# Altium project radxa_nx5_io_board_v1.4.PrjPcb (part 1 of 2)
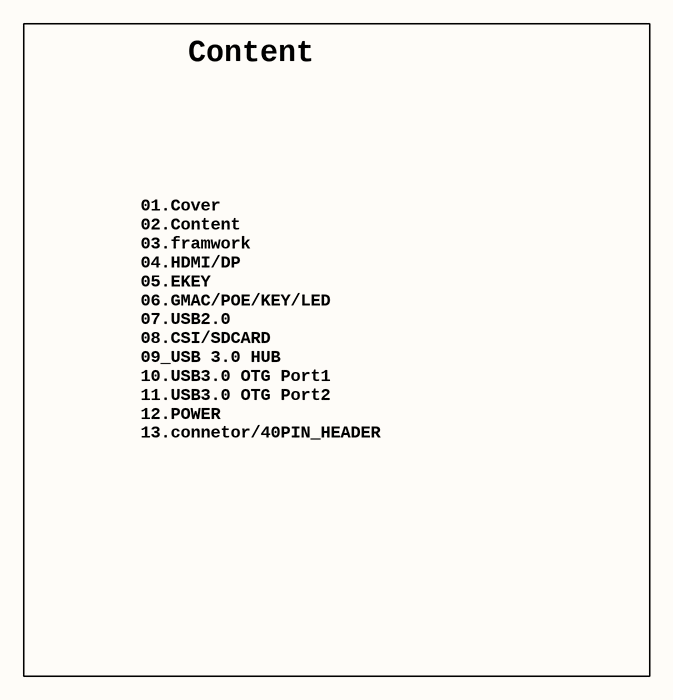
[diagram p0: 02.SchDoc]
12 sheets, 296 parts. Net scope: flat (ports and power ports of the same name join across sheets).
Sheets:
  01.SchDoc
  02.SchDoc
  03.SchDoc
  04.SchDoc
  05.SchDoc
  06.SchDoc
  07.SchDoc
  08.SchDoc
  10.SchDoc
  11.SchDoc
  12.SchDoc
  13.SchDoc

## Sheet 01.SchDoc
size 297 x 209 mm

## Sheet 02.SchDoc
size 297 x 209 mm

### Notes on the sheet
- Content
- 01.Cover
  02.Content
  03.framwork
  04.HDMI/DP
  05.EKEY
  06.GMAC/POE/KEY/LED
  07.USB2.0
  08.CSI/SDCARD
  09_USB 3.0 HUB
  10.USB3.0 OTG Port1
  11.USB3.0 OTG Port2
  12.POWER
  13.connetor/40PIN_HEADER

## Sheet 03.SchDoc
size 297 x 209 mm
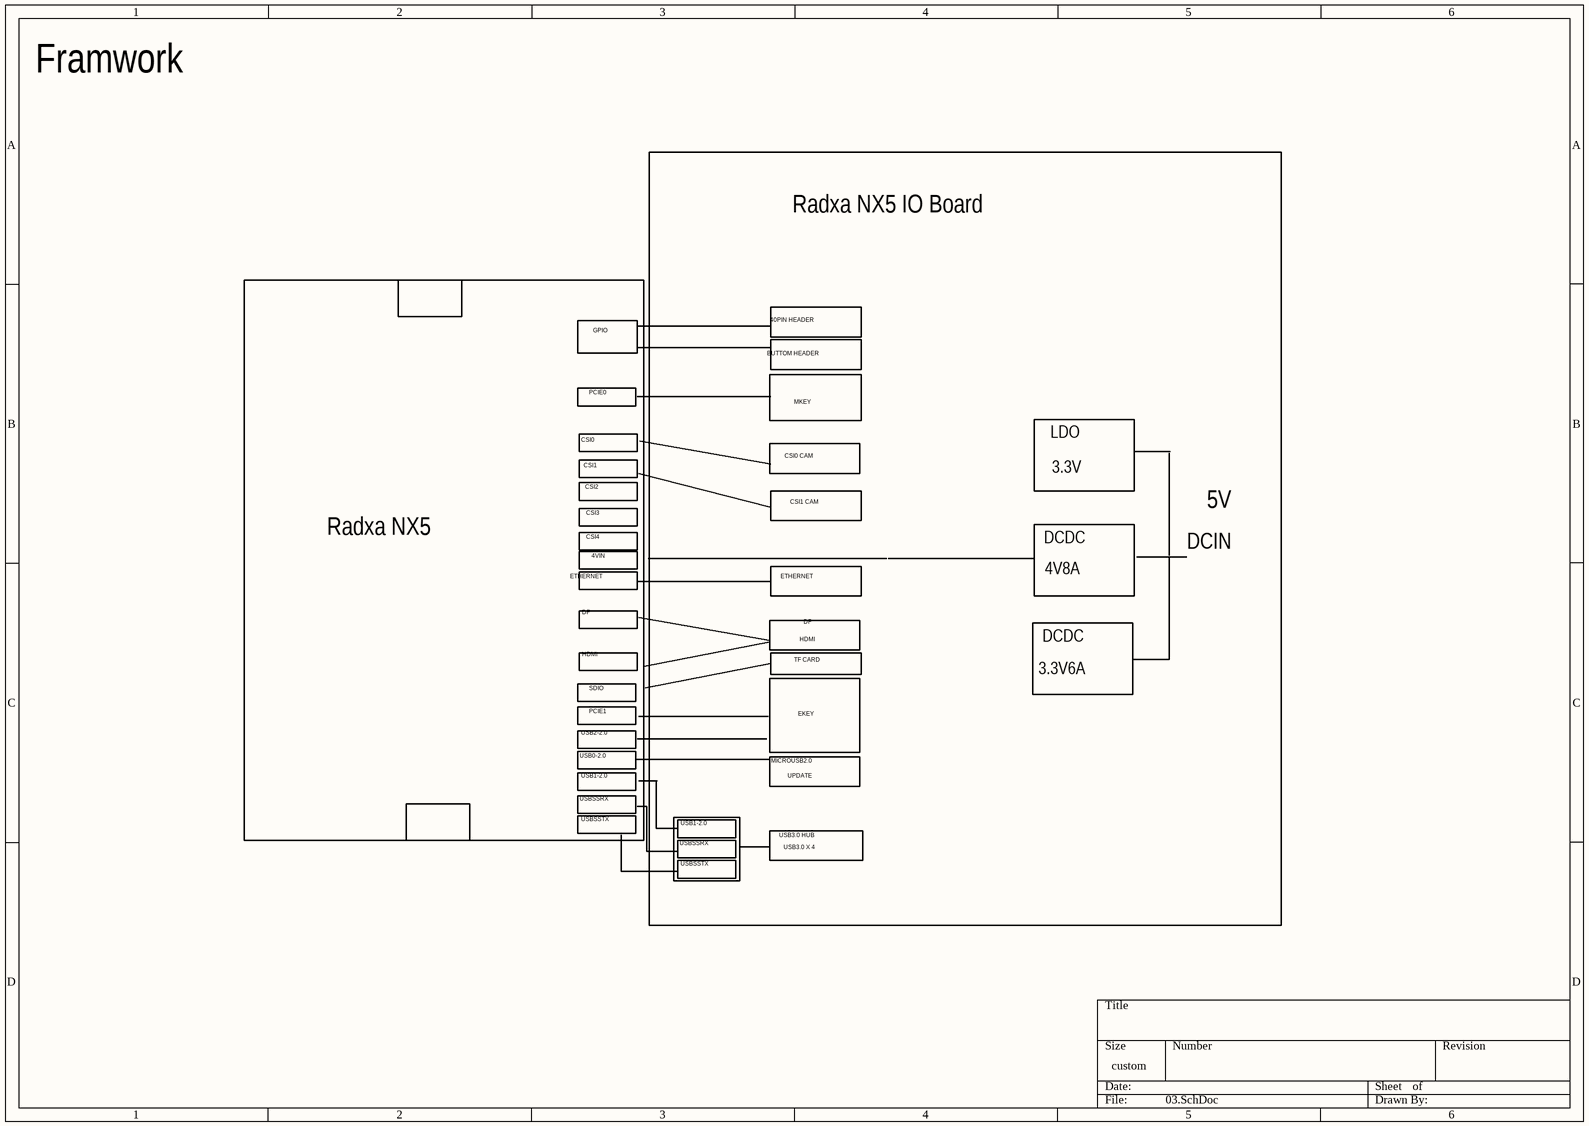
[diagram p1: 03.SchDoc]

### Notes on the sheet
- Framwork
- Radxa NX5 IO Board
- GPIO
- 40PIN HEADER
- PCIE0
- BUTTOM HEADER
- MKEY
- CSI0
- CSI1
- CSI0 CAM
- LDO
- 3.3V
- Radxa NX5
- CSI2
- CSI3
- CSI4
- CSI1 CAM
- 5V
- ETHERNET
- 4VIN
- DCDC
- 4V8A
- DCIN
- HDMI
- DP
- TF CARD
- 3.3V6A
- USB2-2.0
- PCIE1
- SDIO
- EKEY
- USB0-2.0
- USBSSRX
- USB1-2.0
- MICROUSB2.0
- UPDATE
- USBSSTX
- USB3.0 HUB
- USB3.0 X 4

## Sheet 04.SchDoc
size 594 x 420 mm
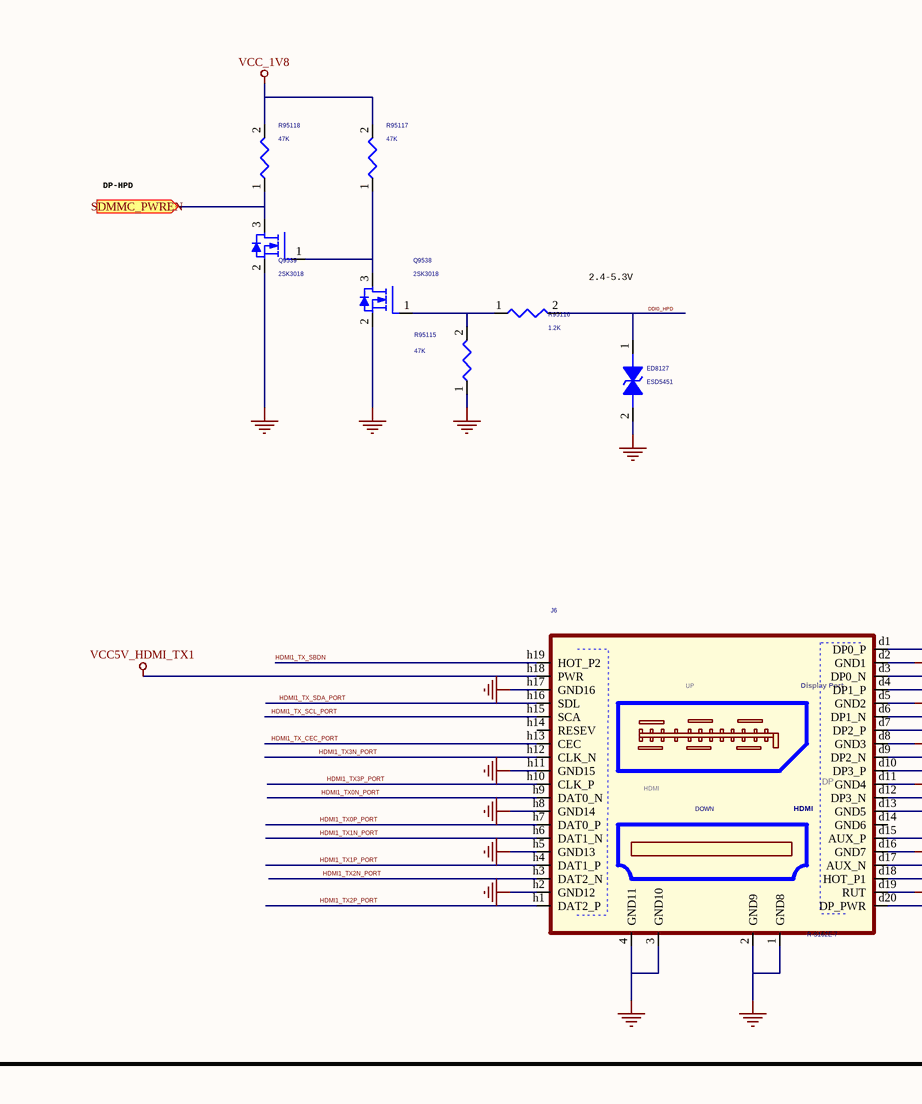
[diagram p2: 04.SchDoc, top left]
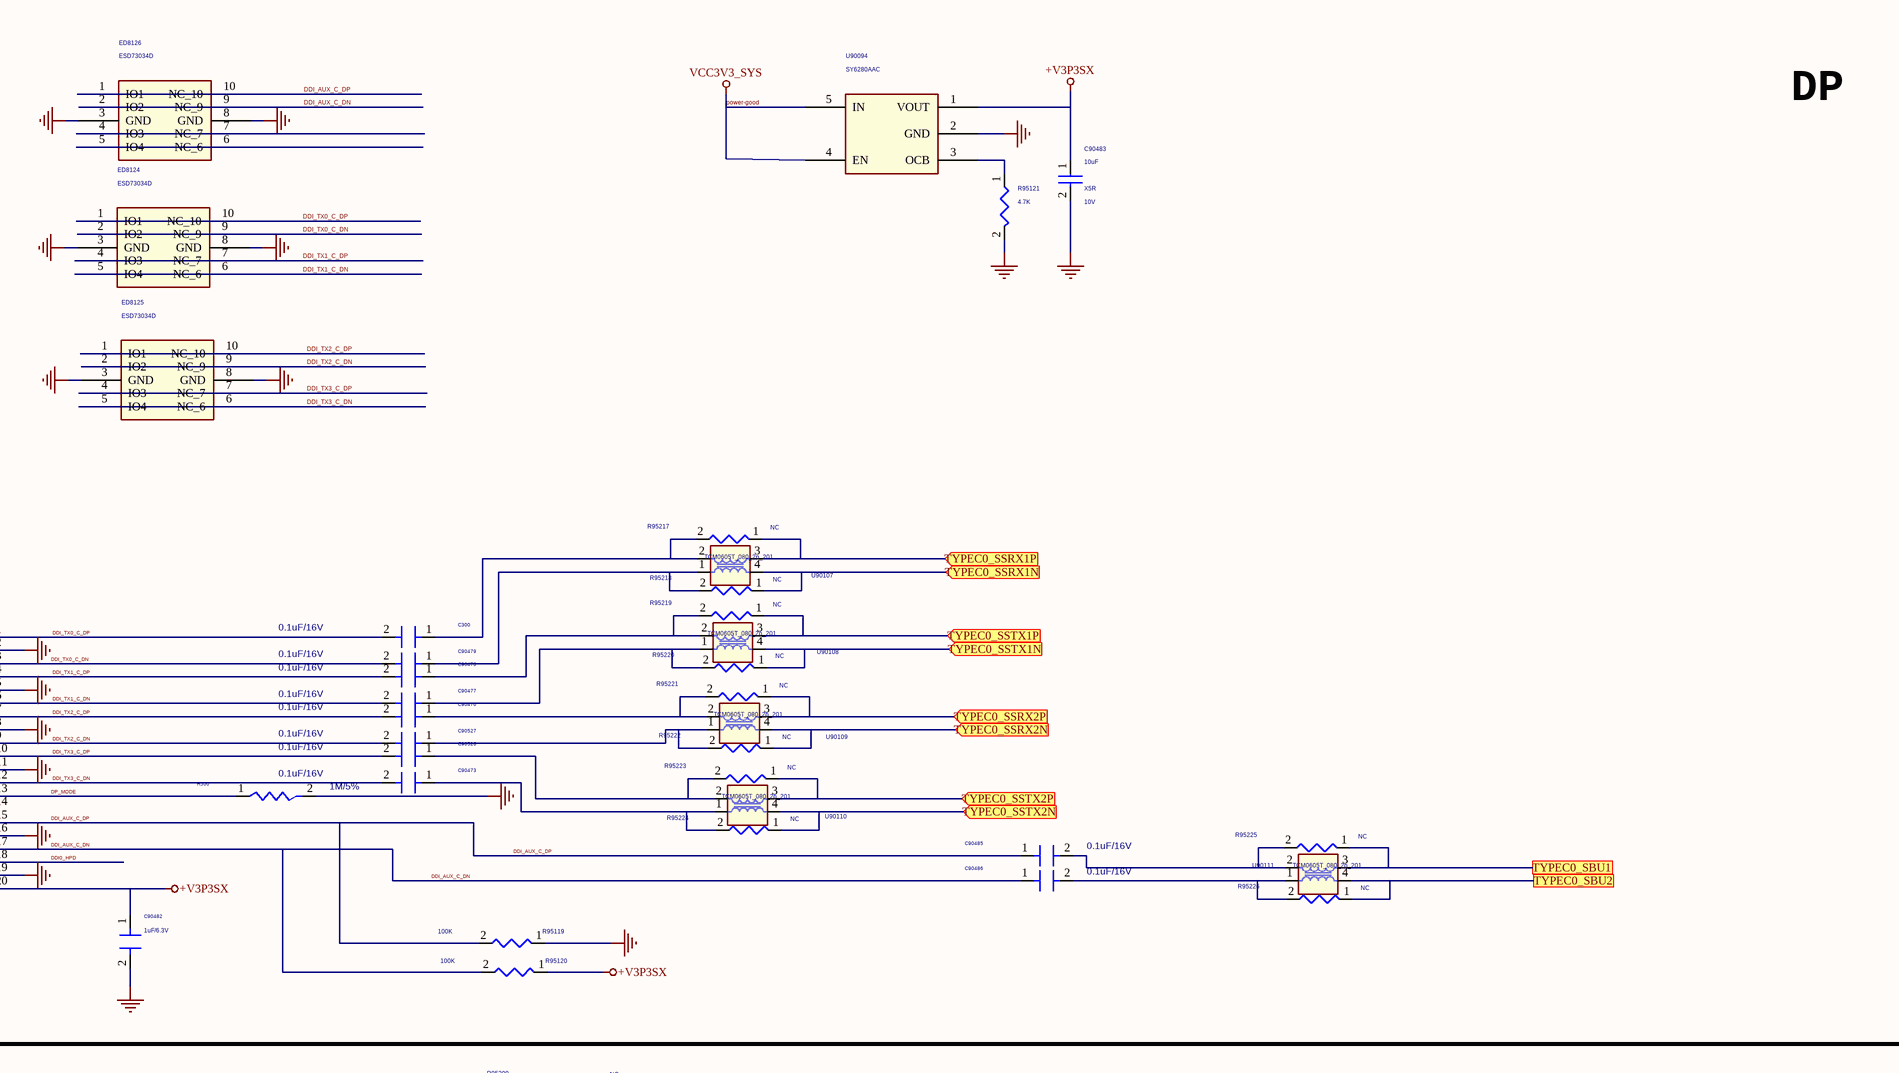
[diagram p3: 04.SchDoc, top right]
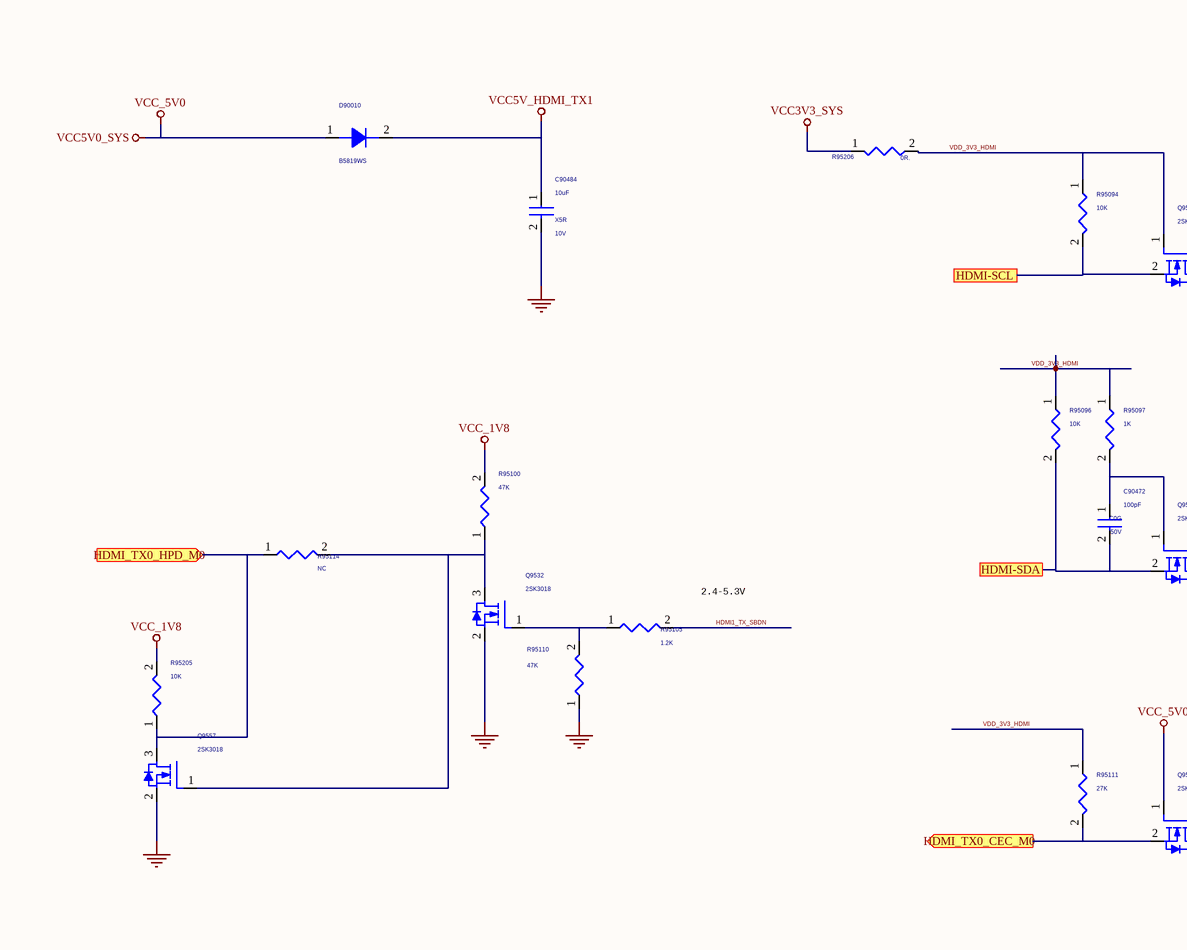
[diagram p4: 04.SchDoc, bottom left]
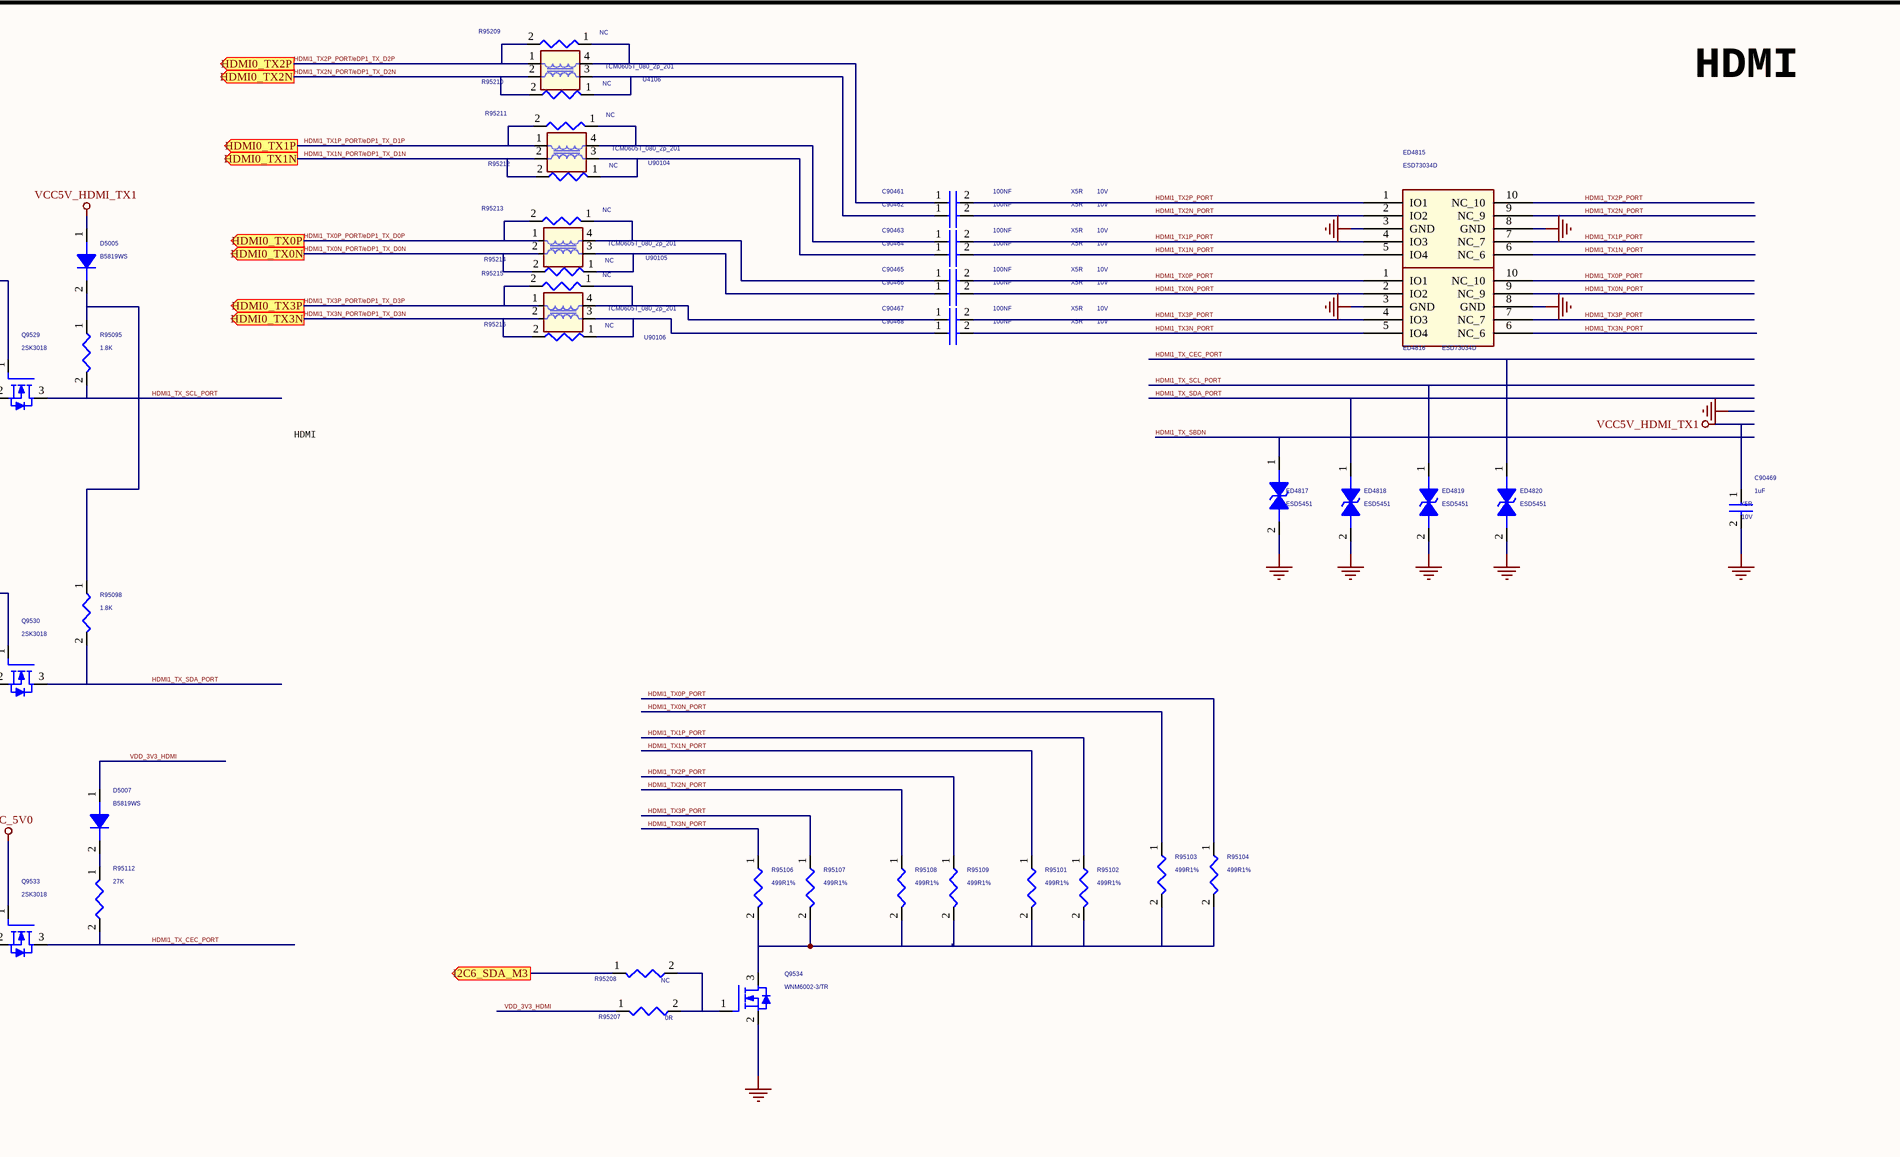
[diagram p5: 04.SchDoc, bottom right]

### Parts
C300  0.1uF/16V  [SMC0201]
C90461  100NF  Voltage: 10V  Dielectric: X5R  [C0201]
C90462  100NF  Voltage: 10V  Dielectric: X5R  [C0201]
C90463  100NF  Voltage: 10V  Dielectric: X5R  [C0201]
C90464  100NF  Voltage: 10V  Dielectric: X5R  [C0201]
C90465  100NF  Voltage: 10V  Dielectric: X5R  [C0201]
C90466  100NF  Voltage: 10V  Dielectric: X5R  [C0201]
C90467  100NF  Voltage: 10V  Dielectric: X5R  [C0201]
C90468  100NF  Voltage: 10V  Dielectric: X5R  [C0201]
C90469  1uF  Voltage: 10V  Dielectric: X5R  [C0402]
C90472  100pF  Voltage: 50V  Dielectric: C0G  [C0402]
C90473  0.1uF/16V  [SMC0201]
C90476  0.1uF/16V  [SMC0201]
C90477  0.1uF/16V  [SMC0201]
C90478  0.1uF/16V  [SMC0201]
C90479  0.1uF/16V  [SMC0201]
C90482  1uF/6.3V  [SMC0402]
C90483  10uF  Voltage: 10V  Dielectric: X5R  [C0603]
C90484  10uF  Voltage: 10V  Dielectric: X5R  [C0603]
C90485  0.1uF/16V  [SMC0201]
C90486  0.1uF/16V  [SMC0201]
C90526  0.1uF/16V  [SMC0201]
C90527  0.1uF/16V  [SMC0201]
D5005  B5819WS  [SOD_323]
D5007  B5819WS  [SOD_323]
D90010  B5819WS  [SOD_323]
ED4815  ESD73034D  [SON10_2R50X1R00X0R50]
ED4816  ESD73034D  [SON10_2R50X1R00X0R50]
ED4817  ESD5451  [ESD0402]
ED4818  ESD5451  [ESD0402]
ED4819  ESD5451  [ESD0402]
ED4820  ESD5451  [ESD0402]
ED8124  ESD73034D  [SON10_2R50X1R00X0R50]
ED8125  ESD73034D  [SON10_2R50X1R00X0R50]
ED8126  ESD73034D  [SON10_2R50X1R00X0R50]
ED8127  ESD5451  [ESD0402]
J6  R-S162E-7  [A]
Q9529  2SK3018  [SOT23]
Q9530  2SK3018  [SOT23]
Q9532  2SK3018  [SOT23]
Q9533  2SK3018  [SOT23]
Q9534  WNM6002-3/TR  [SOT23]
Q9538  2SK3018  [SOT23]
Q9539  2SK3018  [SOT23]
Q9557  2SK3018  [SOT23]
R500  1M/5%  [SMR0402]
R95094  10K  [R0402]
R95095  1.8K  [R0402]
R95096  10K  [R0402]
R95097  1K  [R0402]
R95098  1.8K  [R0402]
R95100  47K  [R0402]
R95101  499R1%  [R0402]
R95102  499R1%  [R0402]
R95103  499R1%  [R0402]
R95104  499R1%  [R0402]
R95105  1.2K  [R0402]
R95106  499R1%  [R0402]
R95107  499R1%  [R0402]
R95108  499R1%  [R0402]
R95109  499R1%  [R0402]
R95110  47K  [R0402]
R95111  27K  [R0402]
R95112  27K  [R0402]
R95114  NC  [R0402]
R95115  47K  [R0402]
R95116  1.2K  [R0402]
R95117  47K  [R0402]
R95118  47K  [R0402]
R95119  100K  [R0402]
R95120  100K  [R0402]
R95121  4.7K  [R0402]
R95205  10K  [R0402]
R95206  0R.  [R0402]
R95207  0R  [R0402]
R95208  NC  [R0402]
R95209  NC  [R0402]
R95210  NC  [R0402]
R95211  NC  [R0402]
R95212  NC  [R0402]
R95213  NC  [R0402]
R95214  NC  [R0402]
R95215  NC  [R0402]
R95216  NC  [R0402]
R95217  NC  [R0402]
R95218  NC  [R0402]
R95219  NC  [R0402]
R95220  NC  [R0402]
R95221  NC  [R0402]
R95222  NC  [R0402]
R95223  NC  [R0402]
R95224  NC  [R0402]
R95225  NC  [R0402]
R95226  NC  [R0402]
U4106  TCM0605T_080_2p_201  [QTCW2012]
U90094  SY6280AAC  [SOT_23_5]
U90104  TCM0605T_080_2p_201  [QTCW2012]
U90105  TCM0605T_080_2p_201  [QTCW2012]
U90106  TCM0605T_080_2p_201  [QTCW2012]
U90107  TCM0605T_080_2p_201  [QTCW2012]
U90108  TCM0605T_080_2p_201  [QTCW2012]
U90109  TCM0605T_080_2p_201  [QTCW2012]
U90110  TCM0605T_080_2p_201  [QTCW2012]
U90111  TCM0605T_080_2p_201  [QTCW2012]

### Ports
HDMI0_TX0N (out), HDMI0_TX0P (out), HDMI0_TX1N (out), HDMI0_TX1P (out), HDMI0_TX2N (out), HDMI0_TX2P (out), HDMI0_TX3N (out), HDMI0_TX3P (out), HDMI-SCL, HDMI-SDA, HDMI_TX0_CEC_M0 (out), HDMI_TX0_HPD_M0 (in), I2C6_SDA_M3 (out), SDMMC_PWREN (in), TYPEC0_SBU1, TYPEC0_SBU2, TYPEC0_SSRX1N (in), TYPEC0_SSRX1P (in), TYPEC0_SSRX2N (in), TYPEC0_SSRX2P (in), TYPEC0_SSTX1N (in), TYPEC0_SSTX1P (in), TYPEC0_SSTX2N (in), TYPEC0_SSTX2P (in)

### Nets
+V3P3SX: C90482.1(A[0]) C90483.1 J6.d20(DP_PWR) R95120.1 U90094.1(VOUT)
GND: C90469.2 C90482.2(B[0]) C90483.2 C90484.2 ED4815.3(GND) ED4815.8(GND) ED4816.3(GND) ED4816.8(GND) ED4817.2 ED4818.2 ED4819.2 ED4820.2 ED8124.3(GND) ED8124.8(GND) ED8125.3(GND) ED8125.8(GND) ED8126.3(GND) ED8126.8(GND) ED8127.2 J6.1(GND8) J6.2(GND9) J6.3(GND10) J6.4(GND11) J6.d2(GND1) J6.d5(GND2) J6.d8(GND3) J6.d11(GND4) J6.d16(GND7) J6.d19(RUT) J6.h2(GND12) J6.h5(GND13) J6.h8(GND14) J6.h11(GND15) J6.h17(GND16) Q9532.2(SOURCE) Q9534.2(SOURCE) Q9538.2(SOURCE) Q9539.2(SOURCE) Q9557.2(SOURCE) R500.2(B[0]) R95110.1 R95115.1 R95119.1 R95121.2 U90094.2(GND)
power-good: R95206.1 U90094.4(EN) U90094.5(IN)  [also labelled VCC3V3_SYS]
VCC5V0_SYS: D90010.1(A) Q9533.1(GATE)  [also labelled VCC_5V0]  [project net DCIN]
VCC5V_HDMI_TX1: C90469.1 C90484.1 D5005.1(A) D90010.2(K) J6.h18(PWR)
VCC_1V8: R95100.2 R95117.2 R95118.2 R95205.2
DDI0_HPD: ED8127.1 J6.d18(HOT_P1) R95116.2
DDI_AUX_C_DN: C90486.1(A[0]) ED8126.2(IO2) ED8126.9(NC_9) J6.d17(AUX_N) R95120.2
DDI_AUX_C_DP: C90485.1(A[0]) ED8126.1(IO1) ED8126.10(NC_10) J6.d15(AUX_P) R95119.2
DDI_TX0_C_DN: C90479.2(B[0]) ED8124.2(IO2) ED8124.9(NC_9) J6.d3(DP0_N)
DDI_TX0_C_DP: C300.2(B[0]) ED8124.1(IO1) ED8124.10(NC_10) J6.d1(DP0_P)
DDI_TX1_C_DN: C90477.2(B[0]) ED8124.5(IO4) ED8124.6(NC_6) J6.d6(DP1_N)
DDI_TX1_C_DP: C90478.2(B[0]) ED8124.4(IO3) ED8124.7(NC_7) J6.d4(DP1_P)
DDI_TX2_C_DN: C90527.2(B[0]) ED8125.2(IO2) ED8125.9(NC_9) J6.d9(DP2_N)
DDI_TX2_C_DP: C90476.2(B[0]) ED8125.1(IO1) ED8125.10(NC_10) J6.d7(DP2_P)
DDI_TX3_C_DN: C90473.2(B[0]) ED8125.5(IO4) ED8125.6(NC_6) J6.d12(DP3_N)
DDI_TX3_C_DP: C90526.2(B[0]) ED8125.4(IO3) ED8125.7(NC_7) J6.d10(DP3_P)
DP_MODE: J6.d13(GND5) R500.1(A[0])
HDMI1_TX0N_PORT: C90466.2 ED4816.2(IO2) ED4816.9(NC_9) J6.h9(DAT0_N) R95103.1
HDMI1_TX0N_PORT/eDP1_TX_D0N: R95214.2 U90105.2 ; port HDMI0_TX0N
HDMI1_TX0P_PORT: C90465.2 ED4816.1(IO1) ED4816.10(NC_10) J6.h7(DAT0_P) R95104.1
HDMI1_TX0P_PORT/eDP1_TX_D0P: R95213.2 U90105.1 ; port HDMI0_TX0P
HDMI1_TX1N_PORT: C90464.2 ED4815.5(IO4) ED4815.6(NC_6) J6.h6(DAT1_N) R95101.1
HDMI1_TX1N_PORT/eDP1_TX_D1N: R95212.2 U90104.2 ; port HDMI0_TX1N
HDMI1_TX1P_PORT: C90463.2 ED4815.4(IO3) ED4815.7(NC_7) J6.h4(DAT1_P) R95102.1
HDMI1_TX1P_PORT/eDP1_TX_D1P: R95211.2 U90104.1 ; port HDMI0_TX1P
HDMI1_TX2N_PORT: C90462.2 ED4815.2(IO2) ED4815.9(NC_9) J6.h3(DAT2_N) R95108.1
HDMI1_TX2N_PORT/eDP1_TX_D2N: R95210.2 U4106.2 ; port HDMI0_TX2N
HDMI1_TX2P_PORT: C90461.2 ED4815.1(IO1) ED4815.10(NC_10) J6.h1(DAT2_P) R95109.1
HDMI1_TX2P_PORT/eDP1_TX_D2P: R95209.2 U4106.1 ; port HDMI0_TX2P
HDMI1_TX3N_PORT: C90468.2 ED4816.5(IO4) ED4816.6(NC_6) J6.h12(CLK_N) R95106.1
HDMI1_TX3N_PORT/eDP1_TX_D3N: R95216.2 U90106.2 ; port HDMI0_TX3N
HDMI1_TX3P_PORT: C90467.2 ED4816.4(IO3) ED4816.7(NC_7) J6.h10(CLK_P) R95107.1
HDMI1_TX3P_PORT/eDP1_TX_D3P: R95215.2 U90106.1 ; port HDMI0_TX3P
HDMI1_TX_CEC_PORT: ED4820.1 J6.h13(CEC) Q9533.3(DRAIN) R95112.2
HDMI1_TX_SBDN: ED4817.1 J6.h19(HOT_P2) R95105.2
HDMI1_TX_SCL_PORT: ED4819.1 J6.h15(SCA) Q9529.3(DRAIN) R95095.2
HDMI1_TX_SDA_PORT: ED4818.1 J6.h16(SDL) Q9530.3(DRAIN) R95098.2
VDD_3V3_HDMI: D5007.1(A) Q9529.1(GATE) R95094.1 R95096.1 R95097.1 R95111.1 R95206.2 R95207.1
NetC300_1: C300.1(A[0]) R95217.2 U90107.2
NetC90461_1: C90461.1 R95209.1 U4106.4
NetC90462_1: C90462.1 R95210.1 U4106.3
NetC90463_1: C90463.1 R95211.1 U90104.4
NetC90464_1: C90464.1 R95212.1 U90104.3
NetC90465_1: C90465.1 R95213.1 U90105.4
NetC90466_1: C90466.1 R95214.1 U90105.3
NetC90467_1: C90467.1 R95215.1 U90106.4
NetC90468_1: C90468.1 R95216.1 U90106.3
NetC90472_1: C90472.1 Q9530.1(GATE) R95097.2
NetC90472_2: C90472.2 Q9530.2(SOURCE) R95096.2 ; port HDMI-SDA
NetC90473_1: C90473.1(A[0]) R95224.2 U90110.1
NetC90476_1: C90476.1(A[0]) R95221.2 U90109.2
NetC90477_1: C90477.1(A[0]) R95220.2 U90108.1
NetC90478_1: C90478.1(A[0]) R95219.2 U90108.2
NetC90479_1: C90479.1(A[0]) R95218.2 U90107.1
NetC90485_2: C90485.2(B[0]) R95225.2 U90111.2
NetC90486_2: C90486.2(B[0]) R95226.2 U90111.1
NetC90526_1: C90526.1(A[0]) R95223.2 U90110.2
NetC90527_1: C90527.1(A[0]) R95222.2 U90109.1
NetD5005_2: D5005.2(K) R95095.1 R95098.1
NetD5007_2: D5007.2(K) R95112.1
NetED8126_4: ED8126.4(IO3) ED8126.7(NC_7)
NetED8126_5: ED8126.5(IO4) ED8126.6(NC_6)
NetQ9529_2: Q9529.2(SOURCE) R95094.2 ; port HDMI-SCL
NetQ9532_1: Q9532.1(GATE) R95105.1 R95110.2
NetQ9532_3: Q9532.3(DRAIN) Q9557.1(GATE) R95100.1 R95114.2
NetQ9533_2: Q9533.2(SOURCE) R95111.2 ; port HDMI_TX0_CEC_M0
NetQ9534_1: Q9534.1(GATE) R95207.2 R95208.2
NetQ9534_3: Q9534.3(DRAIN) R95101.2 R95102.2 R95103.2 R95104.2 R95106.2 R95107.2 R95108.2 R95109.2
NetQ9538_1: Q9538.1(GATE) R95115.2 R95116.1
NetQ9538_3: Q9538.3(DRAIN) Q9539.1(GATE) R95117.1
NetQ9539_3: Q9539.3(DRAIN) R95118.1 ; port SDMMC_PWREN
NetQ9557_3: Q9557.3(DRAIN) R95114.1 R95205.1 ; port HDMI_TX0_HPD_M0
NetR95121_1: R95121.1 U90094.3(OCB)
NetR95208_1: R95208.1 ; port I2C6_SDA_M3
NetR95217_1: R95217.1 U90107.3 ; port TYPEC0_SSRX1P
NetR95218_1: R95218.1 U90107.4 ; port TYPEC0_SSRX1N
NetR95219_1: R95219.1 U90108.3 ; port TYPEC0_SSTX1P
NetR95220_1: R95220.1 U90108.4 ; port TYPEC0_SSTX1N
NetR95221_1: R95221.1 U90109.3 ; port TYPEC0_SSRX2P
NetR95222_1: R95222.1 U90109.4 ; port TYPEC0_SSRX2N
NetR95223_1: R95223.1 U90110.3 ; port TYPEC0_SSTX2P
NetR95224_1: R95224.1 U90110.4 ; port TYPEC0_SSTX2N
NetR95225_1: R95225.1 U90111.3 ; port TYPEC0_SBU1
NetR95226_1: R95226.1 U90111.4 ; port TYPEC0_SBU2

Not connected (* = marked no-connect by the designer): J6 d14(GND6) h14(RESEV)

### Notes on the sheet
- DP
- DP-HPD
- 2.4-5.3V
- HDMI
- (near R95105) 2.4-5.3V
- (in symbol DP+HDMI_1) UP; Display Port; DP; HDMI; DOWN

### Library data of the parts
C300 C90473 C90476 C90486 C90526 = CAP_ALTSIZE: PART_NUMBER: J30788-001; CDS_PART_NAME: CAP_ALTSIZE_0402-0.22UF,10%,16A; MATERIAL: X5R; PACK_TYPE: 0402; ROOM: USB_TYPE_C; TOLERANCE: 10%; VOLTAGE: 16V; OriginalSymbolOrigin: (-50,50); POP2: TYPEC_DP_USB; POP: BASE; CDS_LIB: capacitor; CDS_LOCATION: C4532; DRAWING: @APL_FF_LIN.APL_FF(SCH_1):PAGE72; PHYS_PAGE: 43; ROT: 0; SUB_ROOM: AC_CAP; VER: 2; XY: (-1275,4600); SIZE: 1B; VARIANT: ?; STUFF: STUFF; CDS_PHYS_PART_NAME: CAP_ALTSIZE_0402-0.22UF,10%,16A; CHIPS_PART_NAME: CAP_ALTSIZE; LOCATION: C4532
C90461 C90463 C90465 C90467 C90468 = CAP NP: cap,220.00nF,+/-10%,10V,X5R,C0201; Manufacturer PN: C0603X5R1A224K030BB; Manufacturer: TDK; Tolerance: 10%; Priority: A; Created by: JJJ; Part Type: C0201; RK PN: C0603X5R1A224K030BB
C90462 C90464 C90466 = CAP NP: cap,220.00nF,+/-10%,10V,X5R,C0201; Manufacturer: TDK; RK PN: C0603X5R1A224K030BB; Priority: A; Tolerance: 10%; Part Type: C0201; Manufacturer PN: C0603X5R1A224K030BB; Created by: JJJ
C90469 = CAP NP: cap,1.00uF,+/-10%,10V,X5R,C0402; Manufacturer PN: C1005X5R1A105K050BB; Manufacturer: TDK; Tolerance: 10%; Priority: A; Number: 37; Created by: JJJ; C_Voltage: 10V; Part Type: C0402; RK PN: C1005X5R1A105K050BB
C90472 = CAP NP: cap,100.00pF,+/-10%,50V,C0G,C0402; Manufacturer: TDK; Number: 37; RK PN: C1005C0G1H101K050BA; Priority: A; Tolerance: 10%; C_Voltage: 10V; Part Type: C0402; Manufacturer PN: C1005C0G1H101K050BA; Created by: JJJ
C90477 C90479 C90485 C90527 = CAP_ALTSIZE: PART_NUMBER: J30788-001; CDS_PHYS_PART_NAME: CAP_ALTSIZE_0402-0.22UF,10%,16A; MATERIAL: X5R; PACK_TYPE: 0402; ROOM: USB_TYPE_C; TOLERANCE: 10%; VOLTAGE: 16V; OriginalSymbolOrigin: (-50,50); POP2: TYPEC_DP_USB; XY: (-1275,4600); VER: 2; SUB_ROOM: AC_CAP; ROT: 0; PHYS_PAGE: 43; LOCATION: C4532; DRAWING: @APL_FF_LIN.APL_FF(SCH_1):PAGE72; CDS_LIB: capacitor; POP: BASE; SIZE: 1B; VARIANT: ?; CHIPS_PART_NAME: CAP_ALTSIZE; CDS_PART_NAME: CAP_ALTSIZE_0402-0.22UF,10%,16A; CDS_LOCATION: C4532; STUFF: STUFF
C90478 = CAP_ALTSIZE: PART_NUMBER: J30788-001; CDS_PHYS_PART_NAME: CAP_ALTSIZE_0402-0.22UF,10%,16A; MATERIAL: X5R; PACK_TYPE: 0402; ROOM: USB_TYPE_C; TOLERANCE: 10%; VOLTAGE: 16V; OriginalSymbolOrigin: (-50,50); XY: (-1275,4600); VER: 2; SUB_ROOM: AC_CAP; ROT: 0; PHYS_PAGE: 43; LOCATION: C4532; DRAWING: @APL_FF_LIN.APL_FF(SCH_1):PAGE72; CDS_LIB: capacitor; POP: BASE; POP2: TYPEC_DP_USB; SIZE: 1B; VARIANT: ?; CHIPS_PART_NAME: CAP_ALTSIZE; CDS_PART_NAME: CAP_ALTSIZE_0402-0.22UF,10%,16A; CDS_LOCATION: C4532; STUFF: STUFF
C90482 = CAP_2: PART_NUMBER: H35094-001; CDS_PART_NAME: CAP_0402-2.2UF,20%,10V,X5R,H35A; CHIPS_PART_NAME: CAP; OriginalSymbolOrigin: (-50,50); VOLTAGE: 10V; TOLERANCE: 20%; ROOM: DISPLAY_HDMI; PACK_TYPE: 0402; MATERIAL: X5R; POP: BASE; CDS_LIB: capacitor; CDS_LOCATION: C9589; DRAWING: @APL_FF_LIN.APL_FF(SCH_1):PAGE35; PHYS_PAGE: 35; ROT: 0; SUB_ROOM: DECOUPLING; VER: 1; XY: (-3350,2800); POP2: _; VARIANT: ?; SIZE: 1B; REV: V2.0; LOCATION: C9589; SEC_TYPE: 0402; CDS_PHYS_PART_NAME: CAP_0402-2.2UF,20%,10V,X5R,H35A; STUFF: STUFF
C90483 C90484 = CAP NP: cap,10.00uF,+/-10%,10V,X5R,C0805; Manufacturer PN: C2012X5R1A106K125AB; Manufacturer: TDK; Tolerance: 10%; Priority: A; Created by: JJJ; Part Type: C0805; RK PN: C2012X5R1A106K125AB
D5005 = DIODE_Dup2: Schottky Barrier，B5819WS SOD-323; Manufacturer: 长电; Priority: A; RK PN: B5819WS; Part Type: Schottky rectifier; Manufacturer PN: B5819WS; Created by: JJJ
D5007 = DIODE_Dup2: Schottky Barrier，B5819WS SOD-323; Manufacturer: 长电; option: DNP; Priority: A; RK PN: B5819WS; Part Type: Schottky rectifier; Manufacturer PN: B5819WS; Created by: JJJ
D90010 = DIODE_Dup2: Schottky Barrier，B5819WS SOD-323; Manufacturer: 长电; Priority: A; option: DNP; Created by: JJJ; Manufacturer PN: B5819WS; Part Type: Schottky rectifier; RK PN: B5819WS
ED4815 ED4816 ED8124-ED8126 = ESD_ESD5304D: 4-Lines, Uni-directional, Ultra-low Capacitance Transient Voltage Suppressors; Manufacturer: WillSemi(韦尔半导体); Priority: A; RK PN: ESD5304D; Part Type: ESD_TVS; Manufacturer PN: ESD5304D; Created by: JJJ
ED4817-ED4820 = DIODE BI_DIR TRIG: 1-Line, Bi-directional, Transient Voltage Suppressors.1pF.; Manufacturer PN: ESD5341N; Manufacturer: WillSemi(韦尔半导体); Priority: A; Created by: JJJ; Part Type: ESD_TVS; RK PN: ESD5341N
ED8127 = DIODE BI_DIR TRIG: 1-Line, Bi-directional, Transient Voltage Suppressors.1pF.; Manufacturer: WillSemi(韦尔半导体); RK PN: ESD5341N; Priority: A; Part Type: ESD_TVS; Manufacturer PN: ESD5341N; Created by: JJJ
J6 = DP+HDMI_1: CONN DP+HDMI 62EHDS3 39P+4J+2定位柱 卧式 DIP-45 NPB; COMPSIDE: S_BOT; POP: BASE; Remark: Reserved; STUFF: STUFF
Q9529 Q9530 Q9532 Q9533 Q9557 = MOSFET N_0: NMOS,2SK3018,SOT_323,Id=0.1A,Vds=30V; Manufacturer: ROHM; Pd: 0.2W; Vgsth: 1.5V; VDS: 30V; Vgs: 20V; Id_max: 0.1A; Priority: A; Rds: 5ohm; Created by: JJJ; Manufacturer PN: 2SK3018; Part Type: NMOS; RK PN: 2SK3018
Q9534 = MOSFET N_0: NMOS,WNM6002-3/TR,SOT_323,Id=0.3A,Vds=60V; Manufacturer: WillSemi(韦尔半导体); Pd: 0.23W; Vgsth: 1.3V; VDS: 60V; Vgs: ±20V; Id_max: 0.3A; Priority: A; Created by: JJJ; Manufacturer PN: WNM6002-3/TR; Part Type: NMOS; RK PN: WNM6002-3/TR
Q9538 Q9539 = MOSFET N_0: NMOS,2SK3018,SOT_323,Id=0.1A,Vds=30V; Manufacturer: ROHM; Rds: 5ohm; Priority: A; Id_max: 0.1A; Vgs: 20V; VDS: 30V; Vgsth: 1.5V; Pd: 0.2W; RK PN: 2SK3018; Part Type: NMOS; Manufacturer PN: 2SK3018; Created by: JJJ
R500 = RES#2: PART_NUMBER: A93549-023; CHIPS_PART_NAME: RES; CDS_PHYS_PART_NAME: RES_0402-10K,5%,1/16W,CH,A9354A; PACK_TYPE: 0402; ROOM: USB_TYPE_C; TOLERANCE: 5%; WATTAGE: 1/16W; OriginalSymbolOrigin: (-50,100); POP: BASE; XY: (-2550,2250); VER: 2; SUB_ROOM: MISC; ROT: 0; PHYS_PAGE: 43; LOCATION: R4590; DRAWING: @APL_FF_LIN.APL_FF(SCH_1):PAGE72; CDS_LIB: resistor; POP2: TYPEC_DP_USB; MATERIAL: CH; SIZE: 1B; STUFF: STUFF; CDS_PART_NAME: RES_0402-10K,5%,1/16W,CH,A9354A; CDS_LOCATION: R4590
R95094 R95208-R95224 = RESISTOR: 通用厚膜电阻,10K,+/-5%,R0402,1/16W.; Manufacturer PN: RC0402JR-0710KL; Manufacturer: YAGEO; Tolerance: 5%; Wattage: 1/16W; Priority: A; Created by: YTL; Part Type: 通用厚膜电阻; RK PN: RC0402JR-0710KL
R95095 = RESISTOR: 通用厚膜电阻,1K8,+/-5%,R0402,1/16W.; Manufacturer: YAGEO; Tolerance: 5%; RK PN: RC0402JR-071K8L; Priority: A; Wattage: 1/16W; Part Type: 通用厚膜电阻; Manufacturer PN: RC0402JR-071K8L; Created by: YTL
R95096 R95206 R95207 R95225 R95226 = RESISTOR: 通用厚膜电阻,10K,+/-5%,R0402,1/16W.; Manufacturer: YAGEO; Tolerance: 5%; RK PN: RC0402JR-0710KL; Priority: A; Wattage: 1/16W; Part Type: 通用厚膜电阻; Manufacturer PN: RC0402JR-0710KL; Created by: YTL
R95097 = RESISTOR: 通用厚膜电阻,1K,+/-5%,R0402,1/16W.; Manufacturer PN: RC0402JR-071KL; Manufacturer: YAGEO; Tolerance: 5%; Wattage: 1/16W; Priority: A; Created by: YTL; Part Type: 通用厚膜电阻; RK PN: RC0402JR-071KL
R95098 = RESISTOR: 通用厚膜电阻,1K8,+/-5%,R0402,1/16W.; Manufacturer PN: RC0402JR-071K8L; Manufacturer: YAGEO; Tolerance: 5%; Wattage: 1/16W; Priority: A; Created by: YTL; Part Type: 通用厚膜电阻; RK PN: RC0402JR-071K8L
R95100 R95115 R95117 = RESISTOR: 通用厚膜电阻,47K,+/-5%,R0402,1/16W.; Manufacturer: YAGEO; Tolerance: 5%; RK PN: RC0402JR-0747KL; Priority: A; Wattage: 1/16W; Part Type: 通用厚膜电阻; Manufacturer PN: RC0402JR-0747KL; Created by: YTL
R95101 R95103 R95107-R95109 = RESISTOR: 通用厚膜电阻,499R,+/-1%,R0201,1/20W.; Manufacturer PN: RC0201FR-07499RL; Manufacturer: YAGEO; Tolerance: 1%; Wattage: 1/20W; Priority: A; Created by: YTL; Part Type: 通用厚膜电阻; RK PN: RC0201FR-07499RL
R95102 R95104 R95106 = RESISTOR: 通用厚膜电阻,499R,+/-1%,R0201,1/20W.; Manufacturer: YAGEO; Tolerance: 1%; RK PN: RC0201FR-07499RL; Priority: A; Wattage: 1/20W; Part Type: 通用厚膜电阻; Manufacturer PN: RC0201FR-07499RL; Created by: YTL
R95105 R95114 = RESISTOR: 通用厚膜电阻,1K2,+/-5%,R0402,1/16W.; Manufacturer PN: RC0402JR-071K2L; Manufacturer: YAGEO; Tolerance: 5%; Wattage: 1/16W; Priority: A; Created by: YTL; Part Type: 通用厚膜电阻; RK PN: RC0402JR-071K2L
R95110 R95118 R95205 = RESISTOR: 通用厚膜电阻,47K,+/-5%,R0402,1/16W.; Manufacturer PN: RC0402JR-0747KL; Manufacturer: YAGEO; Tolerance: 5%; Wattage: 1/16W; Priority: A; Created by: YTL; Part Type: 通用厚膜电阻; RK PN: RC0402JR-0747KL
R95111 = RESISTOR: 通用厚膜电阻,27K,+/-5%,R0402,1/16W.; Manufacturer PN: RC0402JR-0727KL; Manufacturer: YAGEO; Tolerance: 5%; Wattage: 1/16W; Priority: A; Created by: YTL; Part Type: 通用厚膜电阻; RK PN: RC0402JR-0727KL
R95112 = RESISTOR: 通用厚膜电阻,27K,+/-5%,R0402,1/16W.; Manufacturer PN: RC0402JR-0727KL; Manufacturer: YAGEO; Tolerance: 5%; OPTION: DNP; Wattage: 1/16W; Priority: A; Created by: YTL; Part Type: 通用厚膜电阻; RK PN: RC0402JR-0727KL
R95116 = RESISTOR: 通用厚膜电阻,1K2,+/-5%,R0402,1/16W.; Manufacturer: YAGEO; Tolerance: 5%; RK PN: RC0402JR-071K2L; Priority: A; Wattage: 1/16W; Part Type: 通用厚膜电阻; Manufacturer PN: RC0402JR-071K2L; Created by: YTL
R95119 = RESISTOR: 通用厚膜电阻,100K,+/-5%,R0402,1/16W.; Manufacturer PN: RC0402JR-07100KL; Manufacturer: YAGEO; Tolerance: 5%; Wattage: 1/16W; Priority: A; Created by: YTL; Part Type: 通用厚膜电阻; RK PN: RC0402JR-07100KL
R95120 = RESISTOR: 通用厚膜电阻,100K,+/-5%,R0402,1/16W.; Manufacturer: YAGEO; Tolerance: 5%; RK PN: RC0402JR-07100KL; Priority: A; Wattage: 1/16W; Part Type: 通用厚膜电阻; Manufacturer PN: RC0402JR-07100KL; Created by: YTL
R95121 = RESISTOR: 通用厚膜电阻,9K1,+/-1%,R0402,1/16W.; Manufacturer: YAGEO; Tolerance: 1%; RK PN: RC0402FR-079K1L; Priority: A; Wattage: 1/16W; Part Type: 通用厚膜电阻; Manufacturer PN: RC0402FR-079K1L; Created by: YTL
U4106 U90104-U90111 = QTCW2012-090-LF_0: Part-V: NC-E2012-090-F
U90094 = SWITCH_SY6280: Low Loss Power Distribution Switch; Manufacturer: Silergy（矽力杰）; Priority: A; RK PN: SY6280AAC; Part Type: Switch; Manufacturer PN: SY6280AAC; Created by: JJJ

## Sheet 05.SchDoc
size 297 x 209 mm
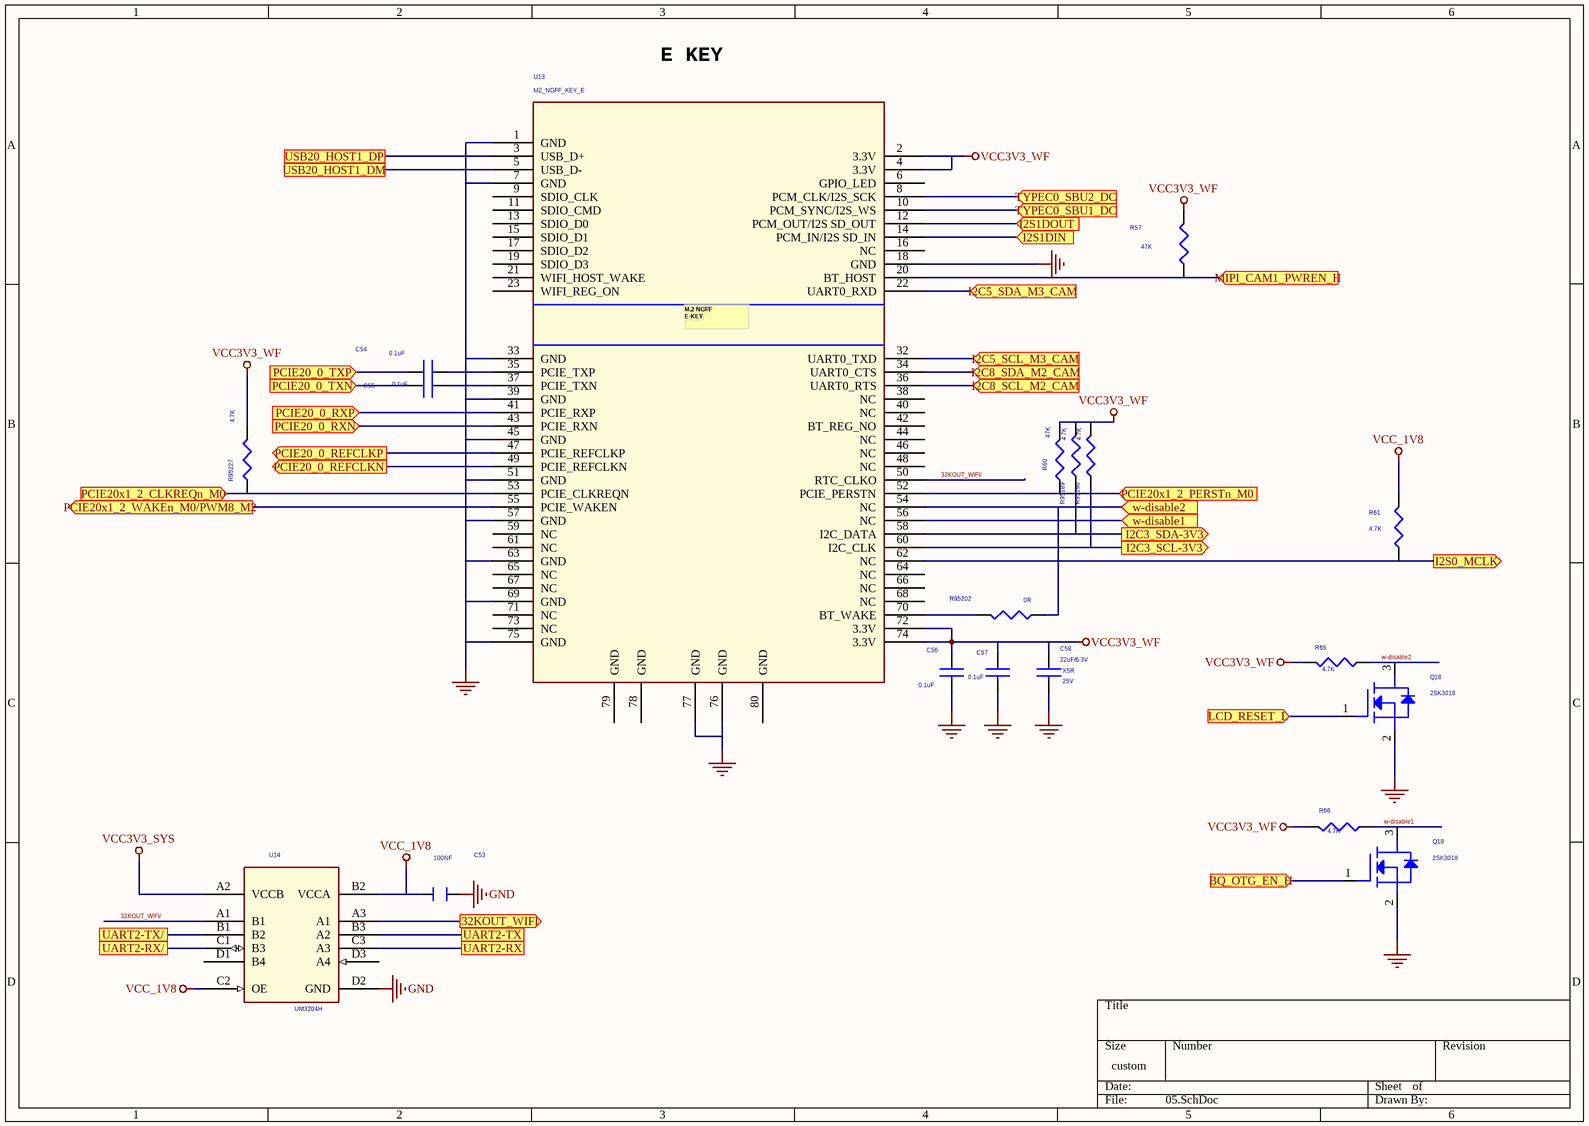
[diagram p6: 05.SchDoc]

### Parts
C53  100NF  [C0402]
C54  0.1uF  [C0603]
C55  0.1uF  [C0603]
C56  0.1uF  [C0402]
C57  0.1uF  [C0402]
C58  22uF/6.3V  Dielectric: X5R  Voltage: 25V  [C0805]
Q18  2SK3018  [SOT23]
Q19  2SK3018  [SOT23]
R57  47K  [R0402]
R60  47K  [R0402]
R61  4.7K  [R0402]
R65  4.7K  [R0402]
R66  4.7K  [R0402]
R95189  4.7K  [R0402]
R95190  4.7K  [R0402]
R95202  0R  [R0402]
R95227  4.7K  [R0402]
U13  M2_NGFF_KEY_E  [M2_NGFF_KEY_E_1]
U14  UM3204H  [CSP-12]

### Ports
32KOUT_WIFI (out), BQ_OTG_EN_H (in), I2C3_SCL-3V3 (out), I2C3_SDA-3V3 (out), I2C5_SCL_M3_CAM (in), I2C5_SDA_M3_CAM (in), I2C8_SCL_M2_CAM (in), I2C8_SDA_M2_CAM (in), I2S0_MCLK (out), I2S1DIN (in), I2S1DOUT (in), LCD_RESET_L (in), MIPI_CAM1_PWREN_H (in), PCIE20_0_REFCLKN (out), PCIE20_0_REFCLKP (out), PCIE20_0_RXN (in), PCIE20_0_RXP (in), PCIE20_0_TXN (in), PCIE20_0_TXP (in), PCIE20x1_2_CLKREQn_M0 (in), PCIE20x1_2_PERSTn_M0 (in), PCIE20x1_2_WAKEn_M0/PWM8_M2 (out), TYPEC0_SBU1_DC (in), TYPEC0_SBU2_DC (in), UART2-RX, UART2-RX/, UART2-TX, UART2-TX/, USB20_HOST1_DM, USB20_HOST1_DP, w-disable1 (in), w-disable2 (in)

### Nets
GND: C53.1 C56.2 C57.2 C58.2 Q18.2(SOURCE) Q19.2(SOURCE) U13.1(GND) U13.7(GND) U13.18(GND) U13.33(GND) U13.39(GND) U13.45(GND) U13.51(GND) U13.57(GND) U13.63(GND) U13.69(GND) U13.75(GND) U13.76(GND) U13.77(GND) U14.D2(GND)
VCC3V3_SYS: U14.A2(VCCB)  [project net power-good]
VCC3V3_WF: C56.1 C57.1 C58.1 R57.2 R60.2 R65.2 R66.2 R95189.2 R95190.2 R95227.2 U13.2(3.3V) U13.4(3.3V) U13.72(3.3V) U13.74(3.3V)
VCC_1V8: C53.2 R61.2 U14.B2(VCCA) U14.C2(OE)
32KOUT_WIFI/: U13.50(RTC_CLKO) U14.A1(B1)
w-disable1: Q19.3(DRAIN) R66.1
w-disable2: Q18.3(DRAIN) R65.1
NetC54_1: C54.1 U13.35(PCIE_TXP)
NetC54_2: C54.2 ; port PCIE20_0_TXP
NetC55_1: C55.1 U13.37(PCIE_TXN)
NetC55_2: C55.2 ; port PCIE20_0_TXN
NetCON1_8: U14.B1(B2) ; port UART2-TX/
NetCON1_10: U14.C1(B3) ; port UART2-RX/
NetQ18_1: Q18.1(GATE) ; port LCD_RESET_L
NetQ19_1: Q19.1(GATE) ; port BQ_OTG_EN_H
NetR57_1: R57.1 U13.20(BT_HOST) ; port MIPI_CAM1_PWREN_H
NetR60_1: R60.1 U13.52(PCIE_PERSTN) ; port PCIE20x1_2_PERSTn_M0
NetR61_1: R61.1 U13.62(NC) ; port I2S0_MCLK
NetR95189_1: R95189.1 U13.58(I2C_DATA) ; port I2C3_SDA-3V3
NetR95190_1: R95190.1 U13.60(I2C_CLK) ; port I2C3_SCL-3V3
NetR95202_1: R95202.1 U13.54(NC) ; port w-disable2
NetR95202_2: R95202.2 U13.70(BT_WAKE)
NetR95227_1: R95227.1 U13.53(PCIE_CLKREQN) ; port PCIE20x1_2_CLKREQn_M0
NetU1_99: U13.32(UART0_TXD) ; port I2C5_SCL_M3_CAM
NetU1_101: U13.22(UART0_RXD) ; port I2C5_SDA_M3_CAM
NetU1_103: U13.36(UART0_RTS) ; port I2C8_SCL_M2_CAM
NetU1_105: U13.34(UART0_CTS) ; port I2C8_SDA_M2_CAM
NetU1_121: U13.5(USB_D-) ; port USB20_HOST1_DM
NetU1_123: U13.3(USB_D+) ; port USB20_HOST1_DP
NetU1_131: U13.43(PCIE_RXN) ; port PCIE20_0_RXN
NetU1_133: U13.41(PCIE_RXP) ; port PCIE20_0_RXP
NetU1_160: U13.49(PCIE_REFCLKN) ; port PCIE20_0_REFCLKN
NetU1_162: U13.47(PCIE_REFCLKP) ; port PCIE20_0_REFCLKP
NetU1_179: U13.55(PCIE_WAKEN) ; port PCIE20x1_2_WAKEn_M0/PWM8_M2
NetU1_210: U14.A3(A1) ; port 32KOUT_WIFI
NetU1_220: U13.12(PCM_OUT/I2S_SD_OUT) ; port I2S1DOUT
NetU1_222: U13.14(PCM_IN/I2S_SD_IN) ; port I2S1DIN
NetU1_224: U13.10(PCM_SYNC/I2S_WS) ; port TYPEC0_SBU1_DC
NetU1_226: U13.8(PCM_CLK/I2S_SCK) ; port TYPEC0_SBU2_DC
NetU1_236: U14.B3(A2) ; port UART2-TX
NetU1_238: U14.C3(A3) ; port UART2-RX
NetU13_56: U13.56(NC) ; port w-disable1

Not connected (* = marked no-connect by the designer): U13 6(GPIO_LED) 9(SDIO_CLK) 11(SDIO_CMD) 13(SDIO_D0) 15(SDIO_D1) 16(NC) 17(SDIO_D2) 19(SDIO_D3) 21(WIFI_HOST_WAKE) 23(WIFI_REG_ON) 38(NC) 40(NC) 42(BT_REG_NO) 44(NC) 46(NC) 48(NC) 59(NC) 61(NC) 64(NC) 65(NC) 66(NC) 67(NC) 68(NC) 71(NC) 73(NC) 78(GND) 79(GND) 80(GND); U14 D1(B4) D3(A4)

### Notes on the sheet
- E KEY
- (in symbol M_4.2 NGFF EKEY SOCKET) M.2 NGFF / E-KEY

### Library data of the parts
C53 = CAPACITOR_0: PAGE: 1
C54 C55 = CAP NP_Dup3: RoHS CHIP CAP 1uF +10/-10% 16V X5R
C56 C57 = CAP NP_2: cap,100.00nF,+/-10%,6.3V,X5R,C0402; Manufacturer PN: C1005X5R0J104K050BA; Manufacturer: TDK; Voltage: 16V; Tolerance: 10%; Priority: A; Dielectric: X5R; Created by: JJJ; Part Type: C0402; RK PN: C1005X5R0J104K050BA
C58 = CAP NP_2: cap,4.70uF,+/-10%,6.3V,X5R,C0603; Manufacturer: TDK; RK PN: C1608X5R0J475K080AB; Priority: A; Tolerance: 10%; Part Type: C0603; Manufacturer PN: C1608X5R0J475K080AB; Created by: JJJ
Q18 Q19 = MOSFET N_Dup1: NMOS,2SK3018,SOT_323,Id=0.1A,Vds=30V; Manufacturer: ROHM; Priority: A; Id_max: 0.1A; Vgs: 20V; VDS: 30V; Vgsth: 1.5V; Pd: 0.2W; Rds: 5ohm; RK PN: 2SK3018; Part Type: NMOS; Manufacturer PN: 2SK3018; Created by: JJJ
R57 R60 R61 R65 R66 R95189 R95190 R95202 R95227 = R_2
U13 = M_4.2 NGFF EKEY SOCKET
U14 = MP2610_0: 4-bit Bi-directional Level Shifter UM3204H; Part Number: PI4ULS5V104GAEX; Vendor: PERICOM

## Sheet 06.SchDoc
size 420 x 297 mm
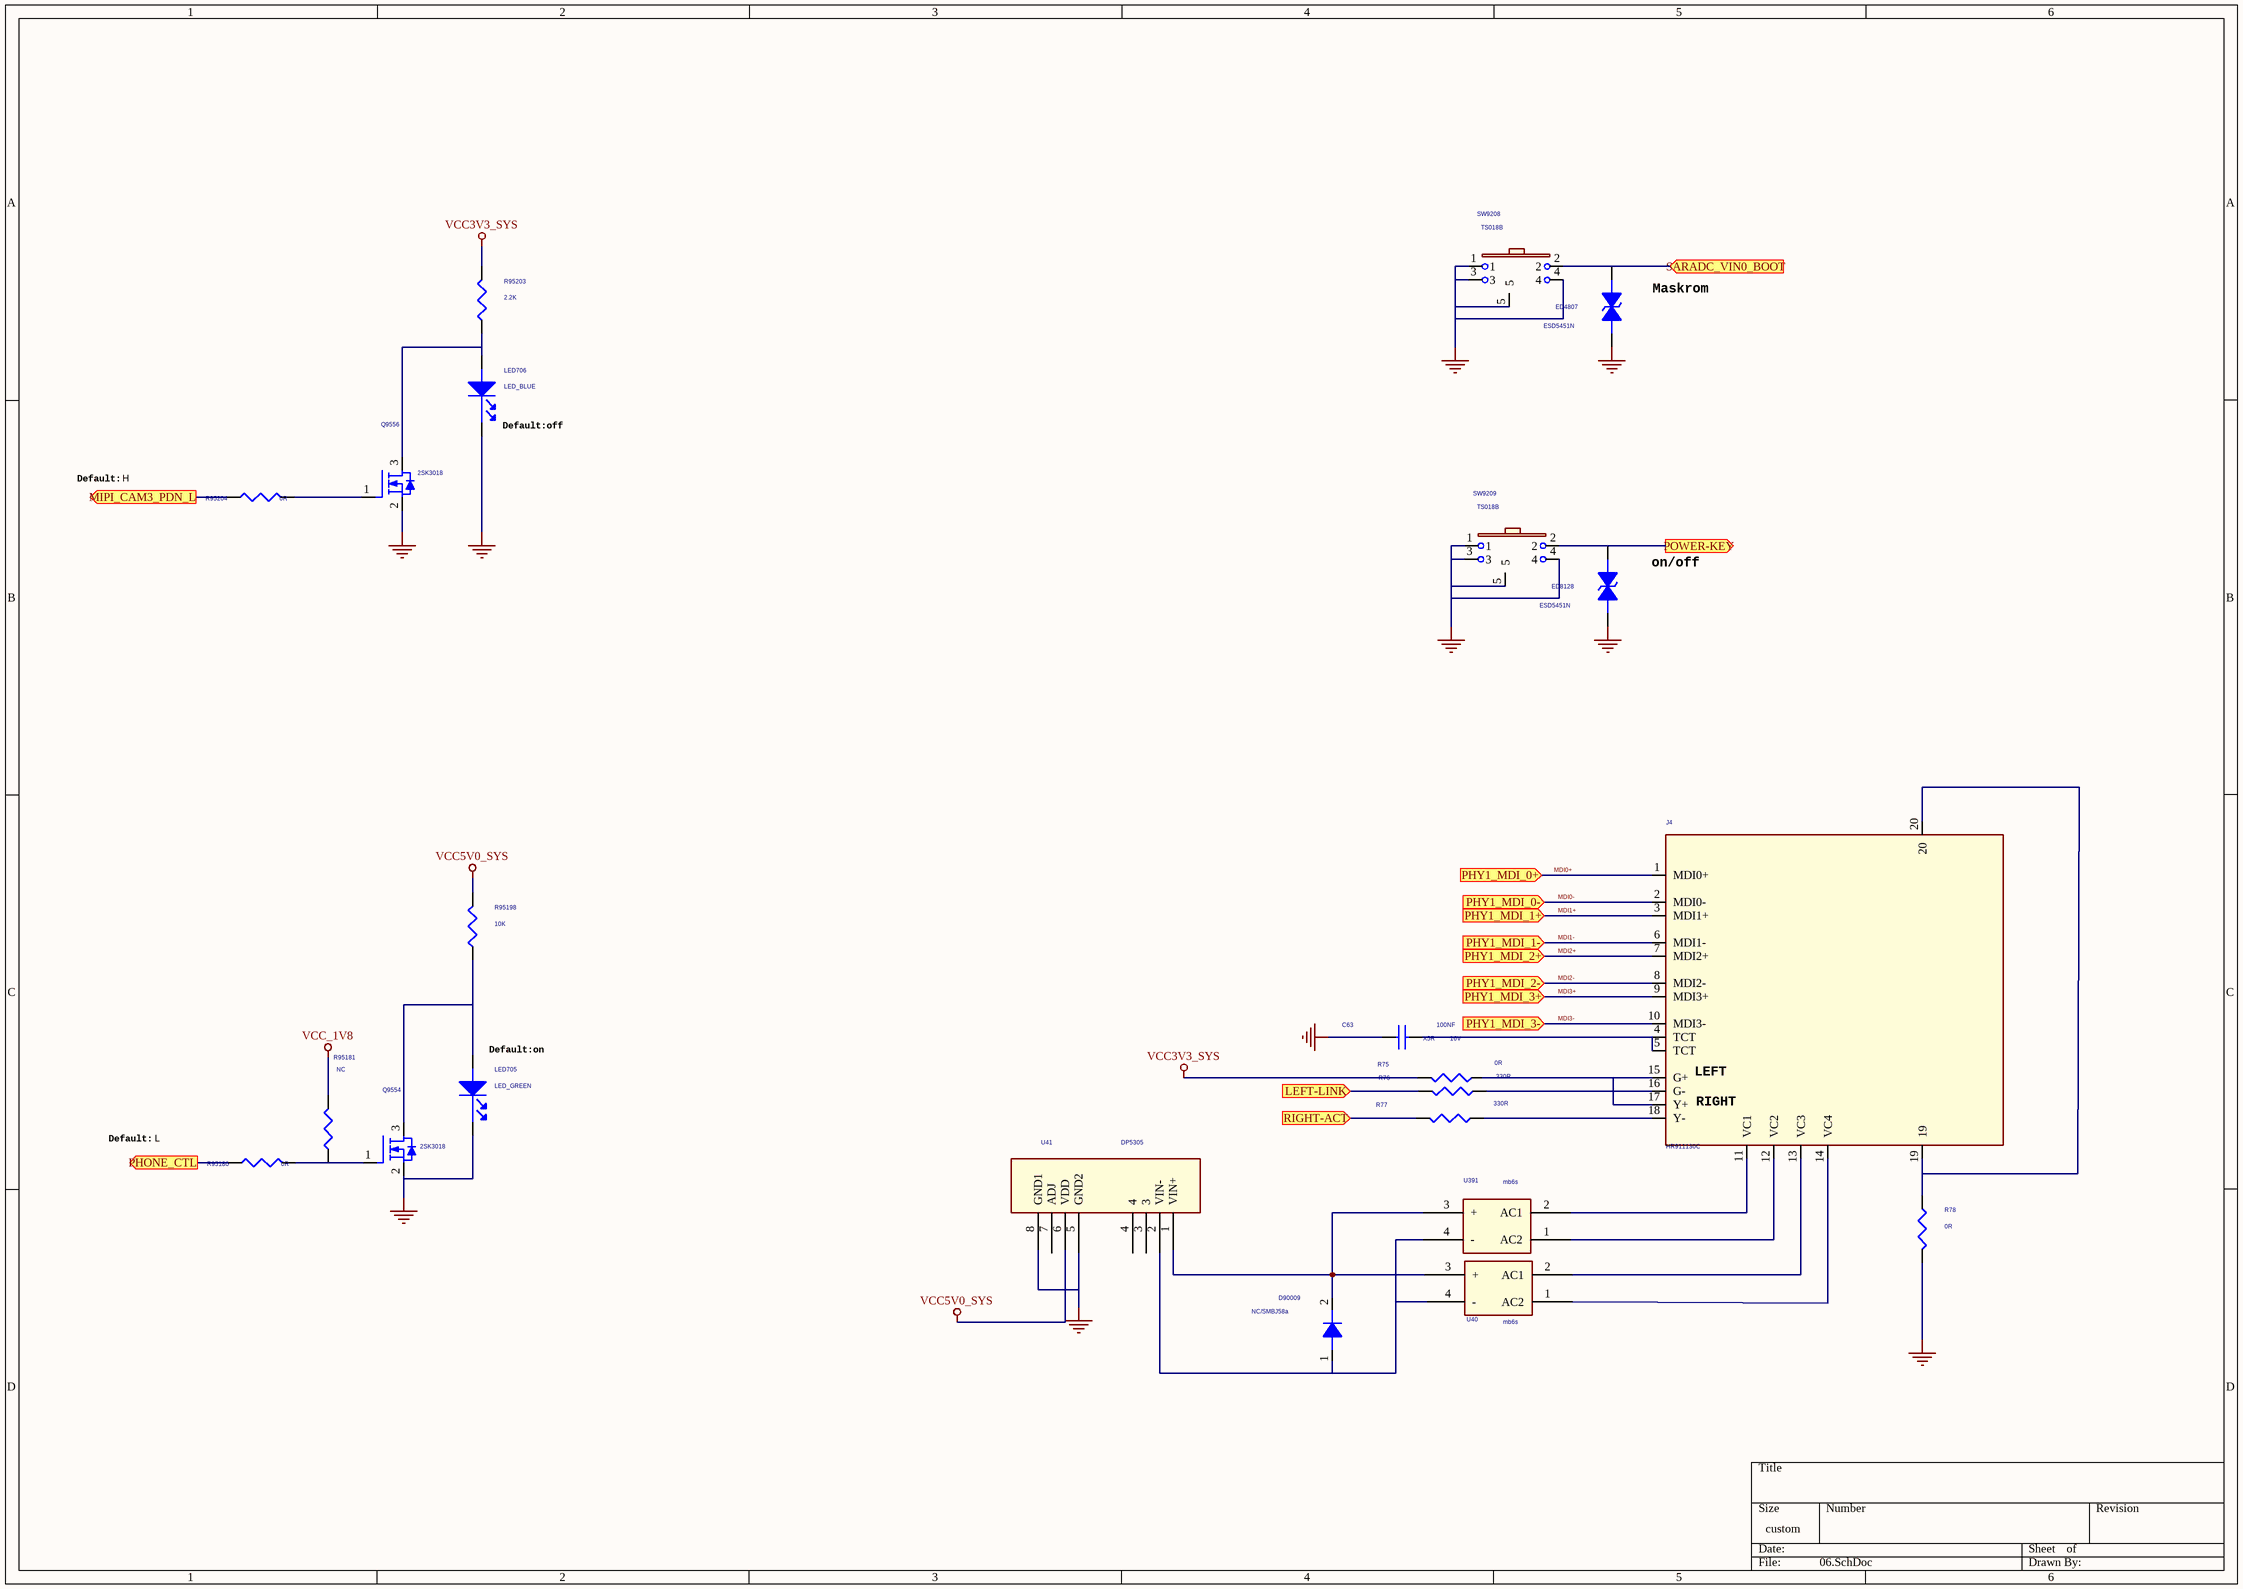
[diagram p7: 06.SchDoc]

### Parts
C63  100NF  Dielectric: X5R  Voltage: 16V  [C0805]
D90009  NC/SMBJ58a  [DO214AA]
ED4807  ESD5451N  [E0402N]
ED8128  ESD5451N  [E0402N]
J4  HR911130C  [RJ45_PULSE]
LED705  LED_GREEN  [LED0603]
LED706  LED_BLUE  [LED0603]
Q9554  2SK3018  [SOT23]
Q9556  2SK3018  [SOT23]
R75  0R  [R0402]
R76  330R  [R0402]
R77  330R  [R0402]
R78  0R  [R0402]
R95180  0R  [R0402]
R95181  NC  [R0402]
R95198  10K  [R0402]
R95203  2.2K  [R0402]
R95204  0R  [R0402]
SW9208  TS018B  [YC-6615B]
SW9209  TS018B  [YC-6615B]
U40  mb6s  [mb6s]
U41  DP5305  [DP5312]
U391  mb6s  [mb6s]

### Ports
LEFT-LINK (in), MIPI_CAM3_PDN_L (out), PHONE_CTL (out), PHY1_MDI_0+ (in), PHY1_MDI_0- (in), PHY1_MDI_1+ (in), PHY1_MDI_1- (in), PHY1_MDI_2+ (in), PHY1_MDI_2- (in), PHY1_MDI_3+ (in), PHY1_MDI_3- (in), POWER-KEY (out), RIGHT-ACT (in), SARADC_VIN0_BOOT (in)

### Nets
GND: C63.1 ED4807.2 ED8128.2 LED705.2(CATHODE) LED706.2(CATHODE) Q9554.2(SOURCE) Q9556.2(SOURCE) R78.1 SW9208.1 SW9208.3 SW9208.4 SW9208.5 SW9209.1 SW9209.3 SW9209.4 SW9209.5 U41.5(GND2) U41.8(GND1)
VCC3V3_SYS: R75.1 R95203.2  [project net power-good]
VCC5V0_SYS: R95198.2 U41.6(VDD)  [project net DCIN]
VCC_1V8: R95181.2
MDI0+: J4.1(MDI0+) ; port PHY1_MDI_0+
MDI0-: J4.2(MDI0-) ; port PHY1_MDI_0-
MDI1+: J4.3(MDI1+) ; port PHY1_MDI_1+
MDI1-: J4.6(MDI1-) ; port PHY1_MDI_1-
MDI2+: J4.7(MDI2+) ; port PHY1_MDI_2+
MDI2-: J4.8(MDI2-) ; port PHY1_MDI_2-
MDI3+: J4.9(MDI3+) ; port PHY1_MDI_3+
MDI3-: J4.10(MDI3-) ; port PHY1_MDI_3-
NetC63_2: C63.2 J4.4(TCT) J4.5(TCT)
NetD90009_1: D90009.1(A) U40.4(-) U41.2(VIN-) U391.4(-)
NetD90009_2: D90009.2(K) U40.3(+) U41.1(VIN+) U391.3(+)
NetED4807_1: ED4807.1 SW9208.2 ; port SARADC_VIN0_BOOT
NetED8128_1: ED8128.1 SW9209.2 ; port POWER-KEY
NetJ4_11: J4.11(VC1) U391.2(AC1)
NetJ4_12: J4.12(VC2) U391.1(AC2)
NetJ4_13: J4.13(VC3) U40.2(AC1)
NetJ4_14: J4.14(VC4) U40.1(AC2)
NetJ4_15: J4.15(G+) J4.17(Y+) R75.2
NetJ4_16: J4.16(G-) R76.2
NetJ4_18: J4.18(Y-) R77.2
NetJ4_19: J4.19 J4.20 R78.2
NetLED705_1: LED705.1(ANODE) Q9554.3(DRAIN) R95198.1
NetLED706_1: LED706.1(ANODE) Q9556.3(DRAIN) R95203.1
NetQ9554_1: Q9554.1(GATE) R95180.2 R95181.1
NetQ9556_1: Q9556.1(GATE) R95204.2
NetR76_1: R76.1 ; port LEFT-LINK
NetR77_1: R77.1 ; port RIGHT-ACT
NetR95180_1: R95180.1 ; port PHONE_CTL
NetR95204_1: R95204.1 ; port MIPI_CAM3_PDN_L

Not connected (* = marked no-connect by the designer): U41 3 4 7(ADJ)

### Notes on the sheet
- (near ED4807) Maskrom
- (near LED706) Default:off
- Default:Ｈ
- (near ED8128) on/off
- (near LED705) Default:on
- (near J4) LEFT
- (near J4) RIGHT
- Default:Ｌ

### Library data of the parts
C63 = CAP NP_2: cap,100.00nF,+/-10%,16V,X5R,C0402; Manufacturer PN: C1005X5R1C104K050BA; Manufacturer: TDK; Tolerance: 10%; Priority: A; Created by: JJJ; Part Type: C0402; RK PN: C1005X5R1C104K050BA
D90009 = DIODE_Dup2: Schottky Barrier，SS32 DO214AC; Manufacturer PN: SS32; Manufacturer: 星海; Priority: A; Created by: JJJ; Part Type: Schottky rectifier; RK PN: SS32
ED4807 = TVS: ESD Component,5V,30P,SMD,0402; BOM_TYPE: 40; BOM_VALUE: 0
ED8128 = TVS: ESD Component,5V,30P,SMD,0402; BOM_VALUE: 0; BOM_TYPE: 40
J4 = HR911130C_0: 千兆网口接口，内置变压器; VAL: J00-0061; DESIG: 10/100 base TX LXT971A; BOI: RJ45; FAB: PULSE; DEV: CON_PULSE_J00-61; Priority: A; REF: J00-0061; Created by: JJJ; Manufacturer Part Number: HR911130C; Part Type: Ethernet Jack; RK PN: HR911130C
LED705 = LED: 贴片LED灯，0603，绿色; Priority: A; RK PN: LED_GREEN; Part Type: LED; Created by: JJJ
LED706 = LED: 贴片LED灯，0603，绿色; Priority: A; RK PN: LED_GREEN; Created by: JJJ; Part Type: LED
Q9554 = MOSFET N_0: as Q9529 on sheet 04; Created by: JJJ; Manufacturer PN: 2SK3018; Part Type: NMOS; RK PN: 2SK3018
Q9556 = MOSFET N_0: as Q9538 on sheet 04; RK PN: 2SK3018; Part Type: NMOS; Manufacturer PN: 2SK3018; Created by: JJJ
R75-R78 = RESISTOR_3: 通用厚膜电阻,100K,+/-5%,R0402,1/16W.; Manufacturer PN: RC0402JR-07100KL; Manufacturer: YAGEO; Tolerance: 5%; Wattage: 1/16W; Priority: A; Created by: YTL; Part Type: 通用厚膜电阻; RK PN: RC0402JR-07100KL
R95180 = RESISTOR_3: 通用厚膜电阻,4K7,+/-1%,R0402,1/16W.; Manufacturer: YAGEO; Tolerance: 1%; RK PN: RC0402FR-074K7L; Priority: A; Wattage: 1/16W; Part Type: 通用厚膜电阻; Manufacturer PN: RC0402FR-074K7L; Created by: YTL
R95181 R95198 R95203 = R_2
R95204 = RESISTOR_3: 通用厚膜电阻,4K7,+/-1%,R0402,1/16W.; Manufacturer PN: RC0402FR-074K7L; Manufacturer: YAGEO; Tolerance: 1%; Wattage: 1/16W; Priority: A; Created by: YTL; Part Type: 通用厚膜电阻; RK PN: RC0402FR-074K7L
SW9208 = KEY_6: 按键，5mm*5mm，直按，插焊; Manufacturer Part Number: KEY_5X5; Manufacturer: 旺科达; Priority: A; Created by: JJJ; Part Type: KEY; RK PN: KEY_5X5
SW9209 = KEY_6: 按键，5mm*5mm，直按，插焊; Manufacturer: 旺科达; RK PN: KEY_5X5; Priority: A; Part Type: KEY; Manufacturer Part Number: KEY_5X5; Created by: JJJ
U41 = DP5312

## Sheet 07.SchDoc
size 297 x 209 mm
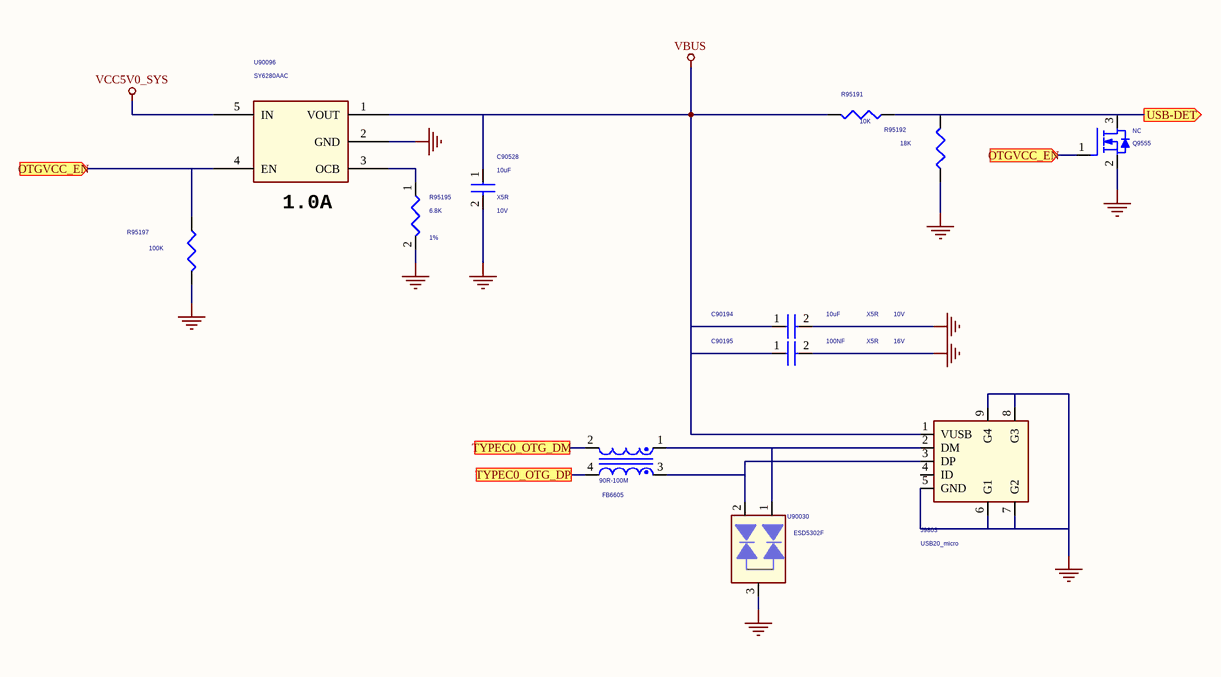
[diagram p8: 07.SchDoc]

### Parts
C90194  10uF  Voltage: 10V  Dielectric: X5R  [C0603]
C90195  100NF  Voltage: 16V  Dielectric: X5R  [C0402]
C90528  10uF  Voltage: 10V  Dielectric: X5R  [C0603]
FB6605  90R-100M  [L0402D]
J9803  USB20_micro  [USB-5PAA]
Q9555  NC  [SOT23]
R95191  10K  [R0402]
R95192  18K  [R0402]
R95195  6.8K  Tolerance: 1%  [R0402]
R95197  100K  [R0402]
U90030  ESD5302F  [SOT23]
U90096  SY6280AAC  [SOT_23_5]

### Ports
OTGVCC_EN (in), TYPEC0_OTG_DM, TYPEC0_OTG_DP, USB-DET (out)

### Nets
GND: C90194.2 C90195.2 C90528.2 J9803.5(GND) J9803.6(G1) J9803.7(G2) J9803.8(G3) J9803.9(G4) Q9555.2(SOURCE) R95192.2 R95195.2 R95197.1 U90030.3 U90096.2(GND)
VBUS: C90194.1 C90195.1 C90528.1 J9803.1(VUSB) R95191.2 U90096.1(VOUT)
VCC5V0_SYS: U90096.5(IN)  [project net DCIN]
NetFB6605_1: FB6605.1 J9803.2(DM) U90030.1
NetFB6605_2: FB6605.2 ; port TYPEC0_OTG_DM
NetFB6605_3: FB6605.3 J9803.3(DP) U90030.2
NetFB6605_4: FB6605.4 ; port TYPEC0_OTG_DP
NetQ9555_1: Q9555.1(GATE) R95197.2 U90096.4(EN) ; port OTGVCC_EN
NetQ9555_3: Q9555.3(DRAIN) R95191.1 R95192.1 ; port USB-DET
NetR95195_1: R95195.1 U90096.3(OCB)

Not connected (* = marked no-connect by the designer): J9803 4(ID)

### Notes on the sheet
- (near U90096) 1.0A

### Library data of the parts
C90194 = CAP NP: cap,10.00uF,+/-10%,10V,X5R,C0805; Manufacturer: TDK; RK PN: C2012X5R1A106K125AB; Priority: A; Tolerance: 10%; Part Type: C0805; Manufacturer PN: C2012X5R1A106K125AB; Created by: JJJ
C90195 = CAP NP: cap,100.00nF,+/-10%,16V,X5R,C0402; Manufacturer: TDK; RK PN: C1005X5R1C104K050BA; Priority: A; Tolerance: 10%; Part Type: C0402; Manufacturer PN: C1005X5R1C104K050BA; Created by: JJJ
C90528 = CAP NP: as C90483 on sheet 04; Created by: JJJ; Part Type: C0805; RK PN: C2012X5R1A106K125AB
FB6605 = INDUCTOR COM: Multi-layer common mode filter array For high-speed differential signal lines.Differential mode cut-off frequency:MCZ1210AH series : 2.5GHz typ.MCZ1210CH series : 3.5GHz typ.MCZ1210DH series : 4 to 6GHz typ.; Manufacturer: EMC; RK PN: MCZ1210AH900L2T; Priority: A; DC Resistor: 1.75ohm; Irms: 200mA; Resonace frequency: 90R@100M; Part Type: BEAD; Manufacturer PN: MCZ1210AH900L2T; Created by: JJJ
J9803 = USB20_MICRO: micro型USB2.0座，卧式，贴焊; Manufacturer: 祺华电子; Priority: A; RK PN: USB20_micro; Part Type: USB Jack; Manufacturer Part Number: USB20_micro; Created by: JJJ
Q9555 = MOSFET N_0: as Q9538 on sheet 04; RK PN: 2SK3018; Part Type: NMOS; Manufacturer PN: 2SK3018; Created by: JJJ
R95191 = RESISTOR_1: RES,thick film,47KOhm,+/-5%,1/16W,SMD0402
R95192 = RESISTOR_0: RES,thick film,47KOhm,+/-5%,1/16W,SMD0402; MARK: 51K
R95195 = RESISTOR: 通用厚膜电阻,9K1,+/-1%,R0402,1/16W.; Manufacturer PN: RC0402FR-079K1L; Manufacturer: YAGEO; Wattage: 1/16W; Priority: A; Created by: YTL; Part Type: 通用厚膜电阻; RK PN: RC0402FR-079K1L
R95197 = R_2
U90030 = ESD_ESDA6V8UL: 2-Lines, Uni-directional,Ultra-low Capacitance.Transient Voltage Suppressors; Manufacturer: WillSemi(韦尔半导体); Priority: A; RK PN: ESD5302F; Part Type: ESD_TVS; Manufacturer PN: ESD5302F; Created by: JJJ
U90096 = SWITCH_SY6280: as U90094 on sheet 04; RK PN: SY6280AAC; Part Type: Switch; Manufacturer PN: SY6280AAC; Created by: JJJ

## Sheet 08.SchDoc
size 386 x 246 mm
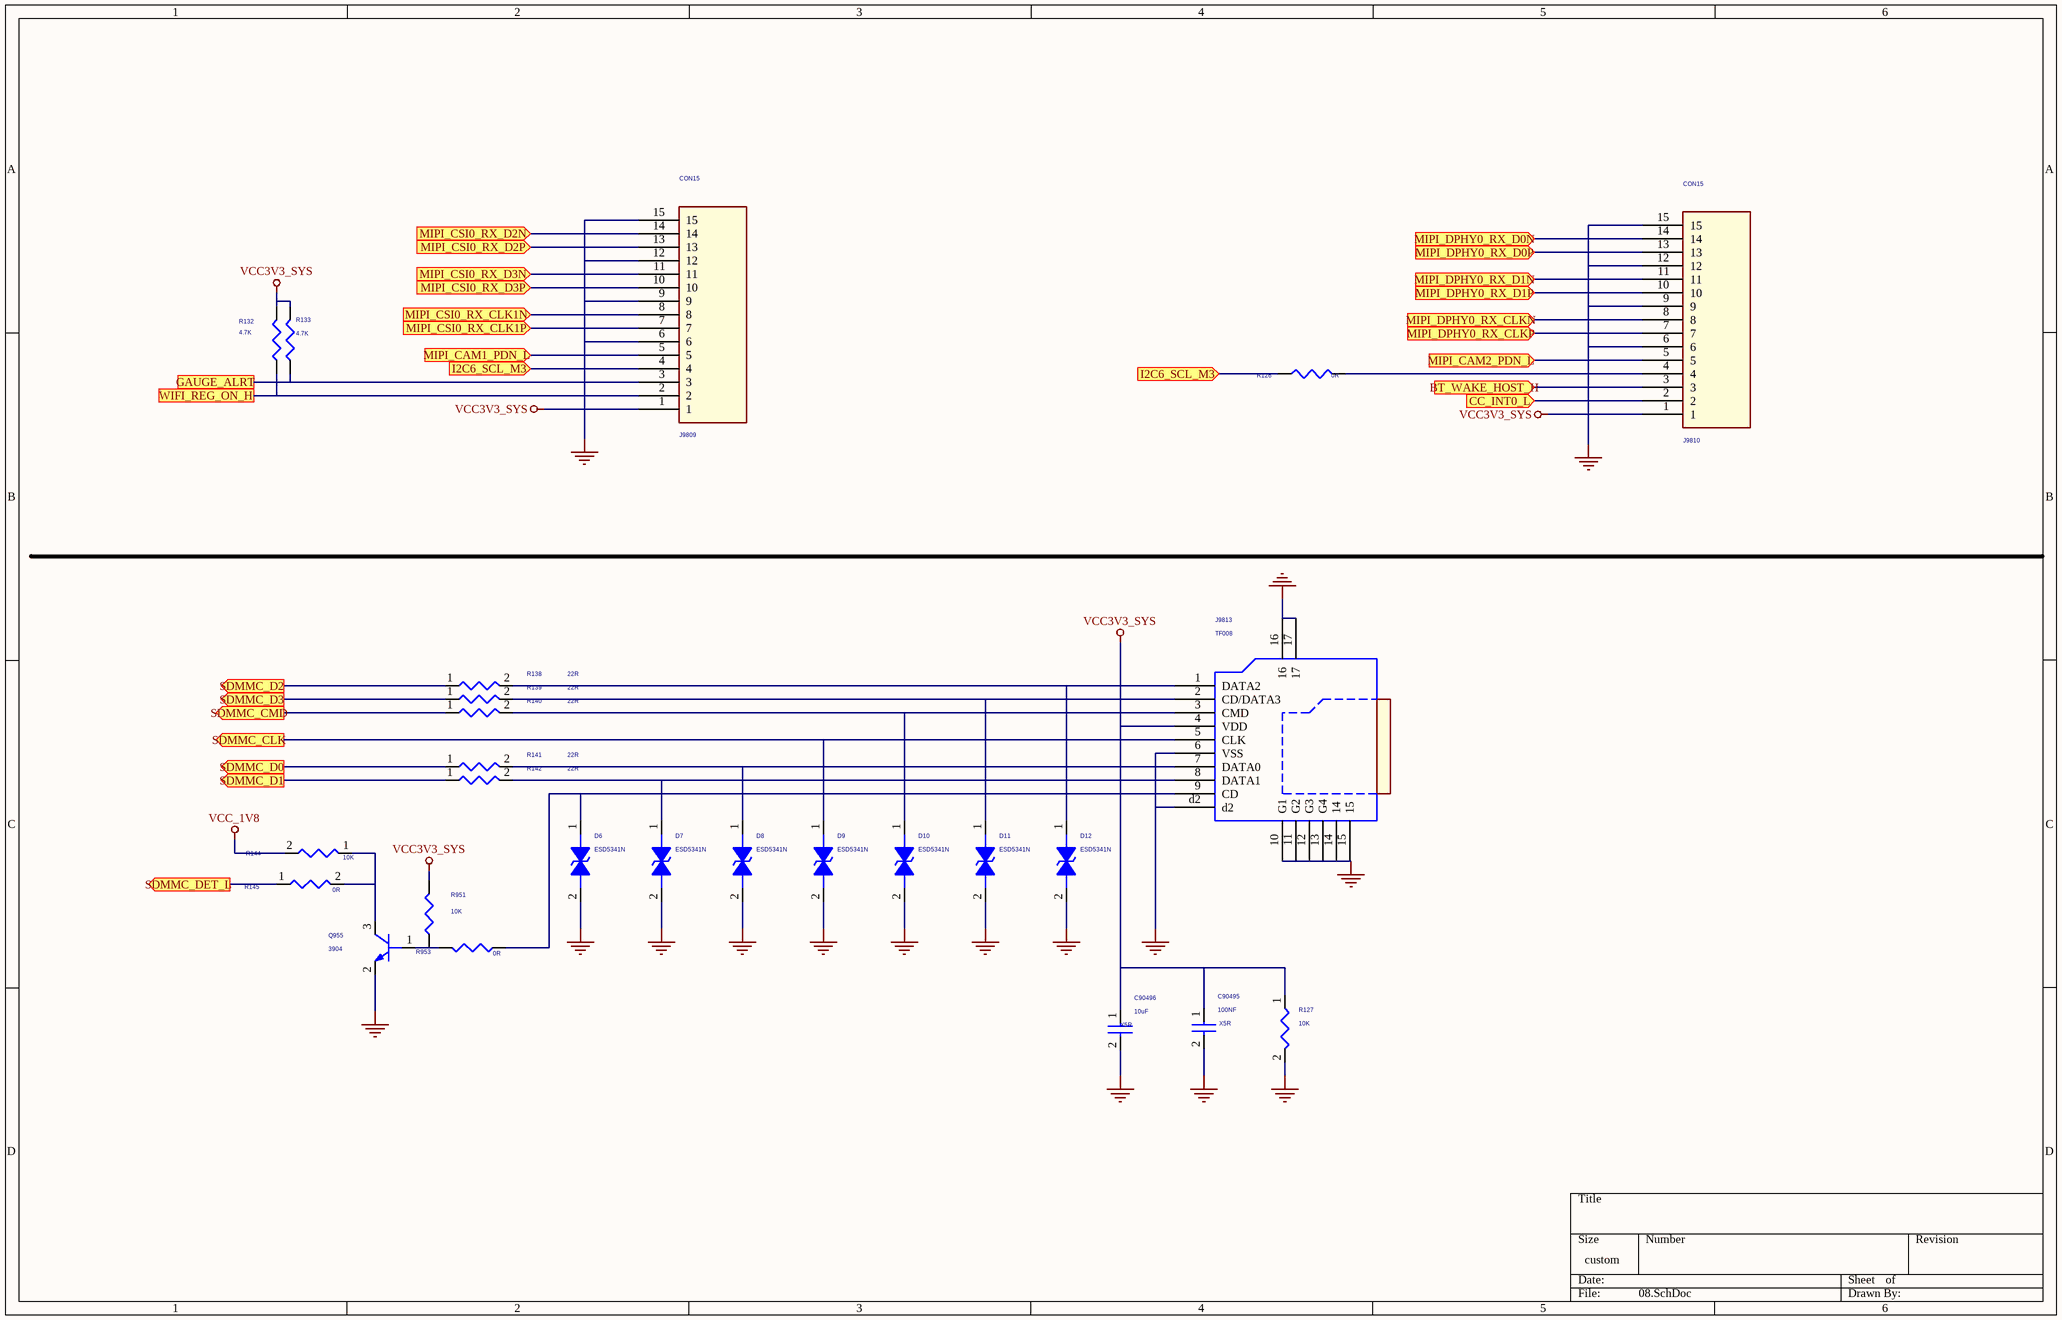
[diagram p9: 08.SchDoc]

### Parts
C90495  100NF  Dielectric: X5R  [R0201]
C90496  10uF  Dielectric: X5R  [C0603]
D6  ESD5341N  [ESD0402]
D7  ESD5341N  [ESD0402]
D8  ESD5341N  [ESD0402]
D9  ESD5341N  [ESD0402]
D10  ESD5341N  [ESD0402]
D11  ESD5341N  [ESD0402]
D12  ESD5341N  [ESD0402]
J9809  CON15  [FPC15PIN-1.0MM-LS]
J9810  CON15  [FPC15PIN-1.0MM-LS]
J9813  TF008  [TF-CKT01-009D]
Q955  3904  [SOT723]
R126  0R  [R0402]
R127  10K  [R0402]
R132  4.7K  [R0402]
R133  4.7K  [R0402]
R138  22R  [R0402]
R139  22R  [R0402]
R140  22R  [R0402]
R141  22R  [R0402]
R142  22R  [R0402]
R144  10K  [R0402]
R145  0R  [R0402]
R951  10K  [R0402]
R953  0R  [R0402]

### Ports
BT_WAKE_HOST_H (in), CC_INT0_L (in), GAUGE_ALRT, I2C6_SCL_M3 (in), MIPI_CAM1_PDN_L (in), MIPI_CAM2_PDN_L (in), MIPI_CSI0_RX_CLK1N (in), MIPI_CSI0_RX_CLK1P (in), MIPI_CSI0_RX_D2N (in), MIPI_CSI0_RX_D2P (in), MIPI_CSI0_RX_D3N (in), MIPI_CSI0_RX_D3P (in), MIPI_DPHY0_RX_CLKN (in), MIPI_DPHY0_RX_CLKP (in), MIPI_DPHY0_RX_D0N (in), MIPI_DPHY0_RX_D0P (in), MIPI_DPHY0_RX_D1N (in), MIPI_DPHY0_RX_D1P (in), SDMMC_CLK (out), SDMMC_CMD (out), SDMMC_D0 (out), SDMMC_D1 (out), SDMMC_D2 (out), SDMMC_D3 (out), SDMMC_DET_L (out), WIFI_REG_ON_H

### Nets
GND: C90495.2 C90496.2 D6.2 D7.2 D8.2 D9.2 D10.2 D11.2 D12.2 J9809.6 J9809.9 J9809.12 J9809.15 J9810.6 J9810.9 J9810.12 J9810.15 J9813.6(VSS) J9813.10(G1) J9813.11(G2) J9813.12(G3) J9813.13(G4) J9813.14 J9813.15 J9813.16 J9813.17 J9813.d2 Q955.2(EMITTER) R127.2
VCC3V3_SYS: C90495.1 C90496.1 J9809.1 J9810.1 J9813.4(VDD) R127.1 R132.2 R133.2 R951.2  [project net power-good]
VCC_1V8: R144.2
NetD6_1: D6.1 J9813.9(CD) R953.1
NetD7_1: D7.1 J9813.8(DATA1) R142.2
NetD8_1: D8.1 J9813.7(DATA0) R141.2
NetD9_1: D9.1 J9813.5(CLK) ; port SDMMC_CLK
NetD10_1: D10.1 J9813.3(CMD) R140.2
NetD11_1: D11.1 J9813.2(CD/DATA3) R139.2
NetD12_1: D12.1 J9813.1(DATA2) R138.2
NetJ9809_2: J9809.2 R132.1 ; port WIFI_REG_ON_H
NetJ9809_3: J9809.3 R133.1 ; port GAUGE_ALRT
NetJ9809_4: J9809.4 R126.1 ; port I2C6_SCL_M3
NetJ9809_5: J9809.5 ; port MIPI_CAM1_PDN_L
NetJ9809_7: J9809.7 ; port MIPI_CSI0_RX_CLK1P
NetJ9809_8: J9809.8 ; port MIPI_CSI0_RX_CLK1N
NetJ9809_10: J9809.10 ; port MIPI_CSI0_RX_D3P
NetJ9809_11: J9809.11 ; port MIPI_CSI0_RX_D3N
NetJ9809_13: J9809.13 ; port MIPI_CSI0_RX_D2P
NetJ9809_14: J9809.14 ; port MIPI_CSI0_RX_D2N
NetJ9810_2: J9810.2 ; port CC_INT0_L
NetJ9810_3: J9810.3 ; port BT_WAKE_HOST_H
NetJ9810_4: J9810.4 R126.2
NetJ9810_5: J9810.5 ; port MIPI_CAM2_PDN_L
NetJ9810_7: J9810.7 ; port MIPI_DPHY0_RX_CLKP
NetJ9810_8: J9810.8 ; port MIPI_DPHY0_RX_CLKN
NetJ9810_10: J9810.10 ; port MIPI_DPHY0_RX_D1P
NetJ9810_11: J9810.11 ; port MIPI_DPHY0_RX_D1N
NetJ9810_13: J9810.13 ; port MIPI_DPHY0_RX_D0P
NetJ9810_14: J9810.14 ; port MIPI_DPHY0_RX_D0N
NetQ955_1: Q955.1(BASE) R951.1 R953.2
NetQ955_3: Q955.3(COLLECTOR) R144.1 R145.2
NetR138_1: R138.1 ; port SDMMC_D2
NetR139_1: R139.1 ; port SDMMC_D3
NetR140_1: R140.1 ; port SDMMC_CMD
NetR141_1: R141.1 ; port SDMMC_D0
NetR142_1: R142.1 ; port SDMMC_D1
NetR145_1: R145.1 ; port SDMMC_DET_L

### Library data of the parts
C90495 = CAP NP: cap,100.00nF,+/-10%,10V,X5R,C0402; Manufacturer: TDK; Number: 37; RK PN: C1005X5R1A104K050BA; Priority: A; Tolerance: 10%; C_Voltage: 6.3V; Voltage: 10V; Part Type: C0402; Manufacturer PN: C1005X5R1A104K050BA; Created by: JJJ
C90496 = CAP NP: cap,10.00uF,+/-10%,10V,X5R,C0603; Manufacturer PN: C1608X5R1A106K080AC; Manufacturer: TDK; Tolerance: 10%; C_Voltage: 6.3V; Priority: A; Voltage: 10V; Created by: JJJ; Part Type: C0603; RK PN: C1608X5R1A106K080AC
D6-D12 = DIODE BI_DIR TRIG: 1-Line, Bi-directional, Transient Voltage Suppressors.1pF.; Manufacturer: WillSemi(韦尔半导体); Priority: A; Created by: JJJ; Manufacturer PN: ESD5341N; Part Type: ESD_TVS; RK PN: ESD5341N
J9809 J9810 = CON15_0
J9813 = TFCARD_SOCKET_0: 通用TF卡座，全尺寸; Manufacturer: 旺科达; Priority: A; RK PN: TF_SOCKET; Created by: JJJ; Manufacturer Part Number: TF-CKT01-009D; Part Type: CARD Jack
Q955 = NPN: S8050,SOT23; Manufacturer: 长电; Manufacturer PN: S8050_SOT23; Priority: A; Ic: 0.5A; Vceo: 25V; Pc: 0.3W; RK PN: S8050; Part Type: NPN; Created by: JJJ
R126 = RESISTOR_3: as R95204 on sheet 06; Created by: YTL; Part Type: 通用厚膜电阻; RK PN: RC0402FR-074K7L
R127 = RESISTOR: 通用厚膜电阻,10K,+/-5%,R0402,1/16W.; Manufacturer: YAGEO; Tolerance: 5%; option: DNP; RK PN: RC0402JR-0710KL; Priority: A; Wattage: 1/16W; Part Type: 通用厚膜电阻; Manufacturer PN: RC0402JR-0710KL; Created by: YTL
R132 R133 = R_2
R138-R141 R144 R145 = RESISTOR: 通用厚膜电阻,22R,+/-5%,R0402,1/16W.; Manufacturer PN: RC0402JR-0722RL; Manufacturer: YAGEO; Tolerance: 5%; Wattage: 1/16W; Priority: A; Created by: YTL; Part Type: 通用厚膜电阻; RK PN: RC0402JR-0722RL
R142 = RESISTOR: 通用厚膜电阻,22R,+/-5%,R0402,1/16W.; Manufacturer: YAGEO; Tolerance: 5%; RK PN: RC0402JR-0722RL; Priority: A; Wattage: 1/16W; Part Type: 通用厚膜电阻; Manufacturer PN: RC0402JR-0722RL; Created by: YTL
R951 = RESISTOR_Dup2: ROHS CHIP RES 200 Ohm 1/16W +/-5%; BOM_TYPE: 20; BOM_VALUE: 0
R953 = RESISTOR_2: 通用厚膜电阻,10K,+/-5%,R0402,1/16W.; Manufacturer: YAGEO; Tolerance: 5%; RK PN: RC0402JR-0710KL; Priority: A; Wattage: 1/16W; Part Type: 通用厚膜电阻; Manufacturer PN: RC0402JR-0710KL; Created by: YTL

## Sheet 10.SchDoc
size 420 x 297 mm
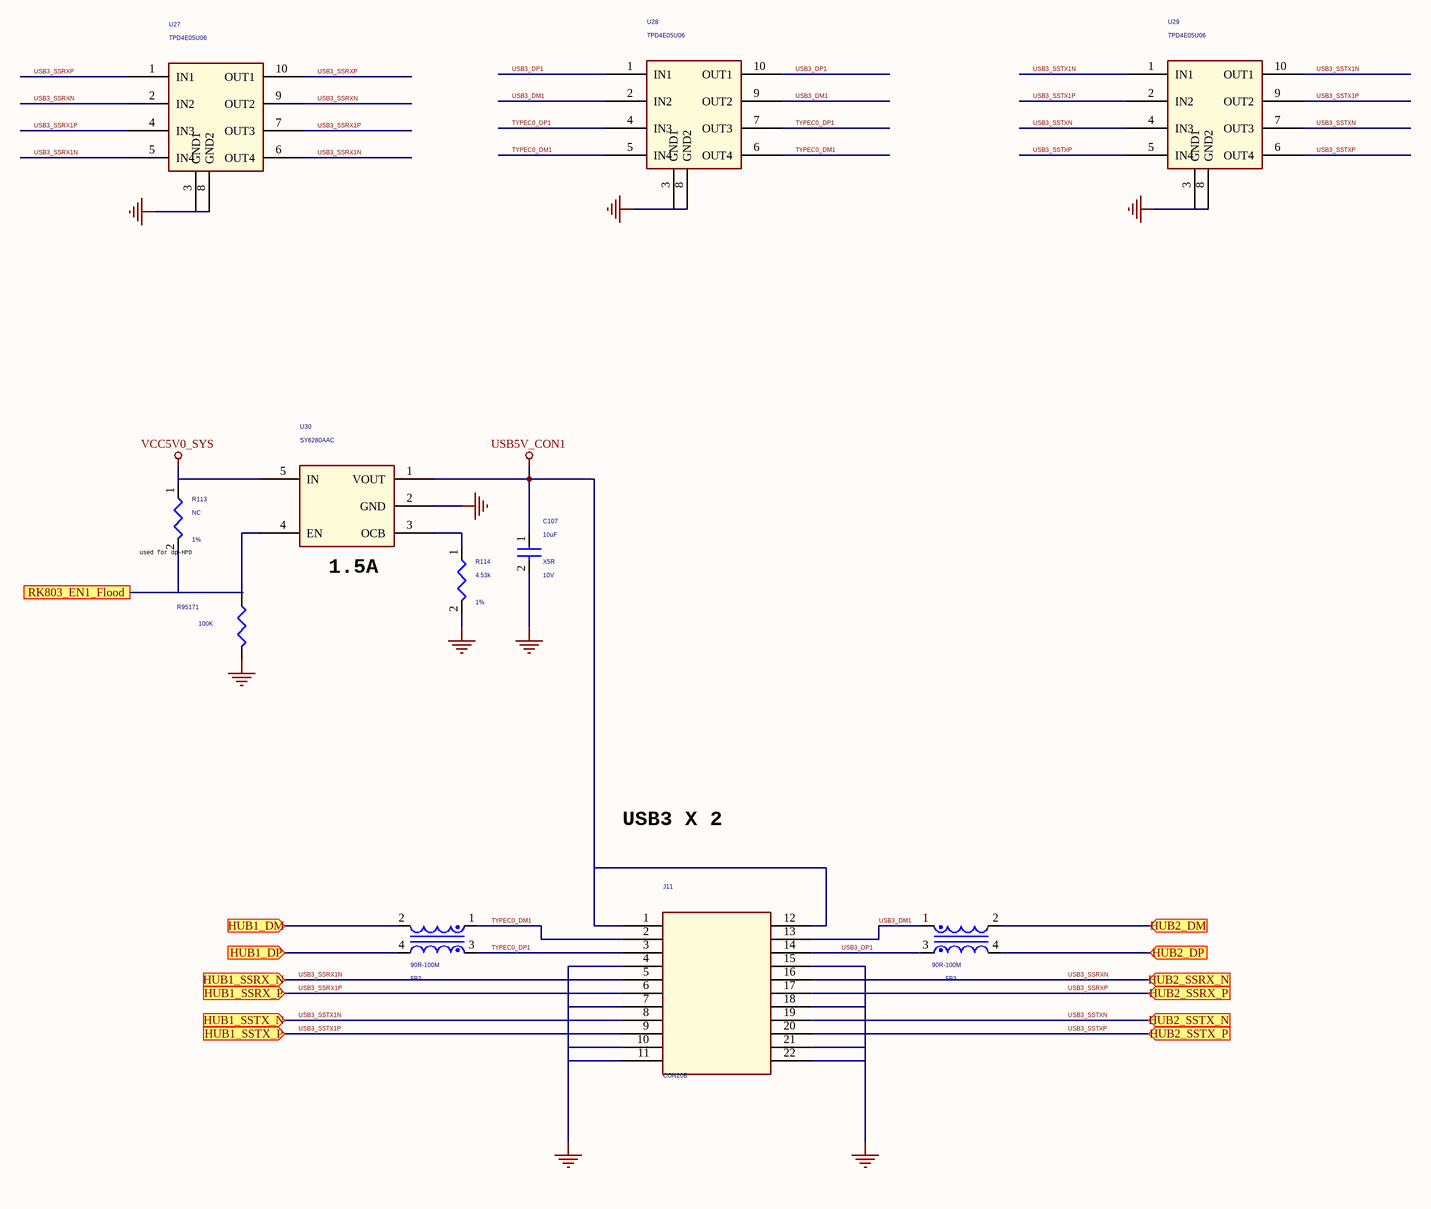
[diagram p10: 10.SchDoc]

### Parts
C107  10uF  Voltage: 10V  Dielectric: X5R  [C0603]
FB2  90R-100M  [L0402D]
FB3  90R-100M  [L0402D]
J11  CON20B  [USB30_DUAL]
R113  NC  Tolerance: 1%  [R0402]
R114  4.53k  Tolerance: 1%  [R0402]
R95171  100K  [R0402]
U27  TPD4E05U06  [SON10_2R50X1R00X0R50]
U28  TPD4E05U06  [SON10_2R50X1R00X0R50]
U29  TPD4E05U06  [SON10_2R50X1R00X0R50]
U30  SY6280AAC  [SOT_23_5]

### Ports
HUB1_DM (in), HUB1_DP (in), HUB1_SSRX_N (in), HUB1_SSRX_P (in), HUB1_SSTX_N (in), HUB1_SSTX_P (in), HUB2_DM (in), HUB2_DP (in), HUB2_SSRX_N (in), HUB2_SSRX_P (in), HUB2_SSTX_N (in), HUB2_SSTX_P (in), RK803_EN1_Flood

### Nets
GND: C107.2 J11.4 J11.7 J11.10 J11.11 J11.15 J11.18 J11.21 J11.22 R114.2 R95171.1 U27.3(GND1) U27.8(GND2) U28.3(GND1) U28.8(GND2) U29.3(GND1) U29.8(GND2) U30.2(GND)
USB5V_CON1: C107.1 J11.1 J11.12 U30.1(VOUT)
VCC5V0_SYS: R113.1 U30.5(IN)  [project net DCIN]
TYPEC0_DM1: FB2.1 J11.2 U28.5(IN4) U28.6(OUT4)
TYPEC0_DP1: FB2.3 J11.3 U28.4(IN3) U28.7(OUT3)
USB3_DM1: FB3.1 J11.13 U28.2(IN2) U28.9(OUT2)
USB3_DP1: FB3.3 J11.14 U28.1(IN1) U28.10(OUT1)
USB3_SSRX1N: J11.5 U27.5(IN4) U27.6(OUT4) ; port HUB1_SSRX_N
USB3_SSRX1P: J11.6 U27.4(IN3) U27.7(OUT3) ; port HUB1_SSRX_P
USB3_SSRXN: J11.16 U27.2(IN2) U27.9(OUT2) ; port HUB2_SSRX_N
USB3_SSRXP: J11.17 U27.1(IN1) U27.10(OUT1) ; port HUB2_SSRX_P
USB3_SSTX1N: J11.8 U29.1(IN1) U29.10(OUT1) ; port HUB1_SSTX_N
USB3_SSTX1P: J11.9 U29.2(IN2) U29.9(OUT2) ; port HUB1_SSTX_P
USB3_SSTXN: J11.19 U29.4(IN3) U29.7(OUT3) ; port HUB2_SSTX_N
USB3_SSTXP: J11.20 U29.5(IN4) U29.6(OUT4) ; port HUB2_SSTX_P
NetFB2_2: FB2.2 ; port HUB1_DM
NetFB2_4: FB2.4 ; port HUB1_DP
NetFB3_2: FB3.2 ; port HUB2_DM
NetFB3_4: FB3.4 ; port HUB2_DP
NetR113_2: R113.2 R95171.2 U30.4(EN) ; port RK803_EN1_Flood
NetR114_1: R114.1 U30.3(OCB)

### Notes on the sheet
- (near R113) used for dp-HPD
- (near U30) 1.5A
- USB3 X 2

### Library data of the parts
C107 = CAP NP: as C90194 on sheet 07; Part Type: C0805; Manufacturer PN: C2012X5R1A106K125AB; Created by: JJJ
FB2 = INDUCTOR COM: as FB6605 on sheet 07; Part Type: BEAD; Manufacturer PN: MCZ1210AH900L2T; Created by: JJJ
FB3 = INDUCTOR COM: Multi-layer common mode filter array For high-speed differential signal lines.Differential mode cut-off frequency:MCZ1210AH series : 2.5GHz typ.MCZ1210CH series : 3.5GHz typ.MCZ1210DH series : 4 to 6GHz typ.; Manufacturer PN: MCZ1210AH900L2T; Manufacturer: EMC; Resonace frequency: 90R@100M; Irms: 200mA; DC Resistor: 1.75ohm; Priority: A; Created by: JJJ; Part Type: BEAD; RK PN: MCZ1210AH900L2T
J11 = CON20B_1
R113 R114 = RESISTOR: as R95195 on sheet 07; Created by: YTL; Part Type: 通用厚膜电阻; RK PN: RC0402FR-079K1L
R95171 = R_2
U27-U29 = ESD_TPD4E05U06: unidirectional ESD protection devices with ultra low capacitance; Manufacturer: TI（德州仪器）; Priority: A; RK PN: TPD4E05U06; Part Type: ESD_TVS; Manufacturer PN: TPD4E05U06; Created by: JJJ
U30 = SWITCH_SY6280: as U90094 on sheet 04; Created by: JJJ; Manufacturer PN: SY6280AAC; Part Type: Switch; RK PN: SY6280AAC

## Sheet 11.SchDoc
size 420 x 297 mm
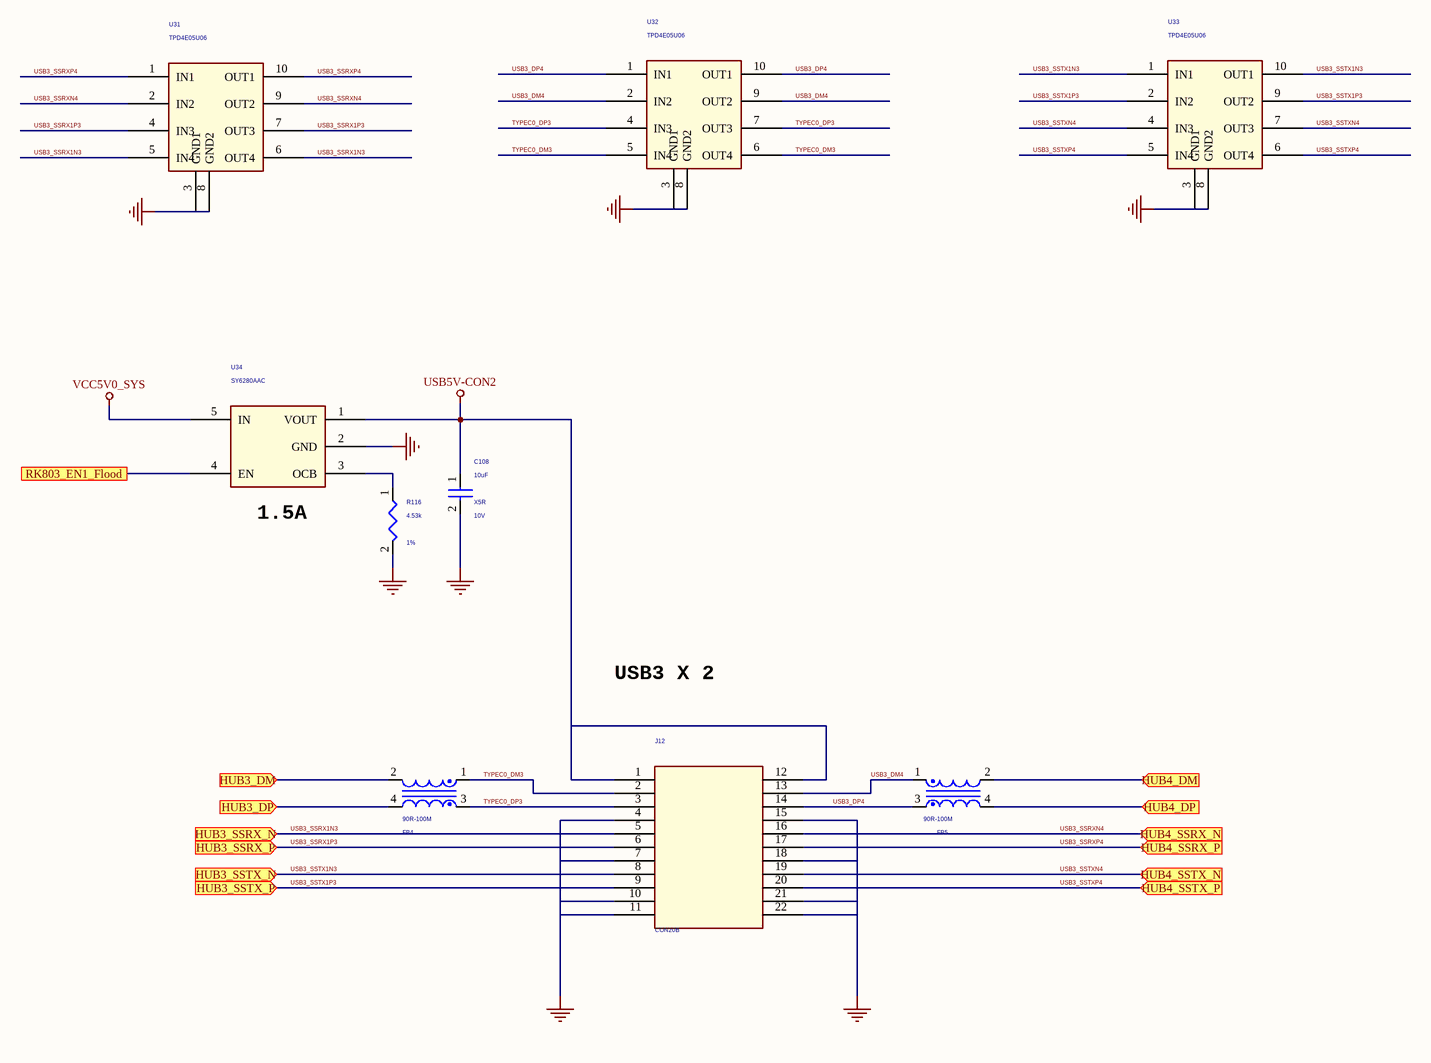
[diagram p11: 11.SchDoc]

### Parts
C108  10uF  Voltage: 10V  Dielectric: X5R  [C0603]
FB4  90R-100M  [L0402D]
FB5  90R-100M  [L0402D]
J12  CON20B  [USB30_DUAL]
R116  4.53k  Tolerance: 1%  [R0402]
U31  TPD4E05U06  [SON10_2R50X1R00X0R50]
U32  TPD4E05U06  [SON10_2R50X1R00X0R50]
U33  TPD4E05U06  [SON10_2R50X1R00X0R50]
U34  SY6280AAC  [SOT_23_5]

### Ports
HUB3_DM (in), HUB3_DP (in), HUB3_SSRX_N (in), HUB3_SSRX_P (in), HUB3_SSTX_N (in), HUB3_SSTX_P (in), HUB4_DM (in), HUB4_DP (in), HUB4_SSRX_N (in), HUB4_SSRX_P (in), HUB4_SSTX_N (in), HUB4_SSTX_P (in), RK803_EN1_Flood

### Nets
GND: C108.2 J12.4 J12.7 J12.10 J12.11 J12.15 J12.18 J12.21 J12.22 R116.2 U31.3(GND1) U31.8(GND2) U32.3(GND1) U32.8(GND2) U33.3(GND1) U33.8(GND2) U34.2(GND)
USB5V-CON2: C108.1 J12.1 J12.12 U34.1(VOUT)
VCC5V0_SYS: U34.5(IN)  [project net DCIN]
TYPEC0_DM3: FB4.1 J12.2 U32.5(IN4) U32.6(OUT4)
TYPEC0_DP3: FB4.3 J12.3 U32.4(IN3) U32.7(OUT3)
USB3_DM4: FB5.1 J12.13 U32.2(IN2) U32.9(OUT2)
USB3_DP4: FB5.3 J12.14 U32.1(IN1) U32.10(OUT1)
USB3_SSRX1N3: J12.5 U31.5(IN4) U31.6(OUT4) ; port HUB3_SSRX_N
USB3_SSRX1P3: J12.6 U31.4(IN3) U31.7(OUT3) ; port HUB3_SSRX_P
USB3_SSRXN4: J12.16 U31.2(IN2) U31.9(OUT2) ; port HUB4_SSRX_N
USB3_SSRXP4: J12.17 U31.1(IN1) U31.10(OUT1) ; port HUB4_SSRX_P
USB3_SSTX1N3: J12.8 U33.1(IN1) U33.10(OUT1) ; port HUB3_SSTX_N
USB3_SSTX1P3: J12.9 U33.2(IN2) U33.9(OUT2) ; port HUB3_SSTX_P
USB3_SSTXN4: J12.19 U33.4(IN3) U33.7(OUT3) ; port HUB4_SSTX_N
USB3_SSTXP4: J12.20 U33.5(IN4) U33.6(OUT4) ; port HUB4_SSTX_P
NetFB4_2: FB4.2 ; port HUB3_DM
NetFB4_4: FB4.4 ; port HUB3_DP
NetFB5_2: FB5.2 ; port HUB4_DM
NetFB5_4: FB5.4 ; port HUB4_DP
NetR113_2: U34.4(EN) ; port RK803_EN1_Flood
NetR116_1: R116.1 U34.3(OCB)

### Notes on the sheet
- (near U34) 1.5A
- USB3 X 2

### Library data of the parts
C108 = CAP NP: as C90194 on sheet 07; Part Type: C0805; Manufacturer PN: C2012X5R1A106K125AB; Created by: JJJ
FB4 = INDUCTOR COM: as FB6605 on sheet 07; Part Type: BEAD; Manufacturer PN: MCZ1210AH900L2T; Created by: JJJ
FB5 = INDUCTOR COM: as FB3 on sheet 10; Created by: JJJ; Part Type: BEAD; RK PN: MCZ1210AH900L2T
J12 = CON20B_1
R116 = RESISTOR: as R95195 on sheet 07; Created by: YTL; Part Type: 通用厚膜电阻; RK PN: RC0402FR-079K1L
U31-U33 = ESD_TPD4E05U06: as U27 on sheet 10; Created by: JJJ; Manufacturer PN: TPD4E05U06; Part Type: ESD_TVS; RK PN: TPD4E05U06
U34 = SWITCH_SY6280: as U90094 on sheet 04; Created by: JJJ; Manufacturer PN: SY6280AAC; Part Type: Switch; RK PN: SY6280AAC